# Altium project TAUV-Regulated_Power.PrjPcb (part 1 of 2)
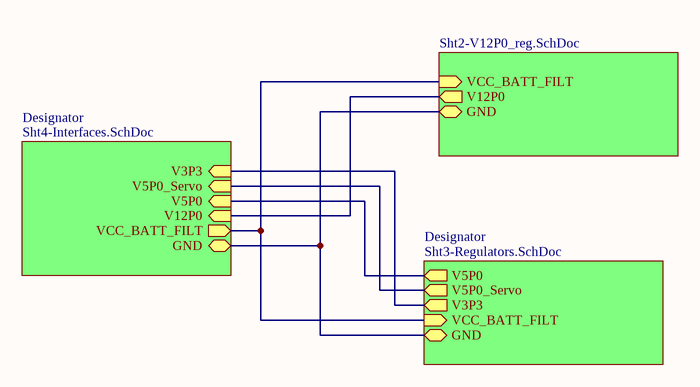
[diagram p0: Sht1-BlockDiagram.SchDoc]
4 sheets, 197 parts. Net scope: hierarchical (ports join the sheet entries above them; power ports are global).
Board file: TAUV-Regulated_Power_board.PcbDoc
Sheets:
  Sht1-BlockDiagram.SchDoc
    Designator = Sht4-Interfaces.SchDoc
  Sht2-Regulators.SchDoc
  Sht3-V12P0_reg.SchDoc

## Sheet Sht1-BlockDiagram.SchDoc
size A; SheetNumber: 1; SheetTotal: 4

### Sub-sheets
Designator = Sht4-Interfaces.SchDoc: VCC_BATT_FILT (out), V12P0 (in), V5P0 (in), V5P0_Servo (in), V3P3 (in), GND (bidir)
Designator = Sht3-Regulators.SchDoc (file not in this document): V5P0 (out), V5P0_Servo (out), V3P3 (out), VCC_BATT_FILT (in), GND (bidir)
? = Sht2-V12P0_reg.SchDoc (file not in this document): VCC_BATT_FILT (in), V12P0 (out), GND (bidir)

### Nets
V12P0: sheet Designator/V12P0, sheet /V12P0
(unnamed): sheet Designator/VCC_BATT_FILT, sheet /VCC_BATT_FILT, sheet Designator/VCC_BATT_FILT
(unnamed): sheet Designator/V5P0, sheet Designator/V5P0
(unnamed): sheet Designator/V5P0_Servo, sheet Designator/V5P0_Servo
(unnamed): sheet Designator/V3P3, sheet Designator/V3P3
(unnamed): sheet Designator/GND, sheet /GND, sheet Designator/GND

## Sheet Sht4-Interfaces.SchDoc
size C; SheetNumber: 4; SheetTotal: 4
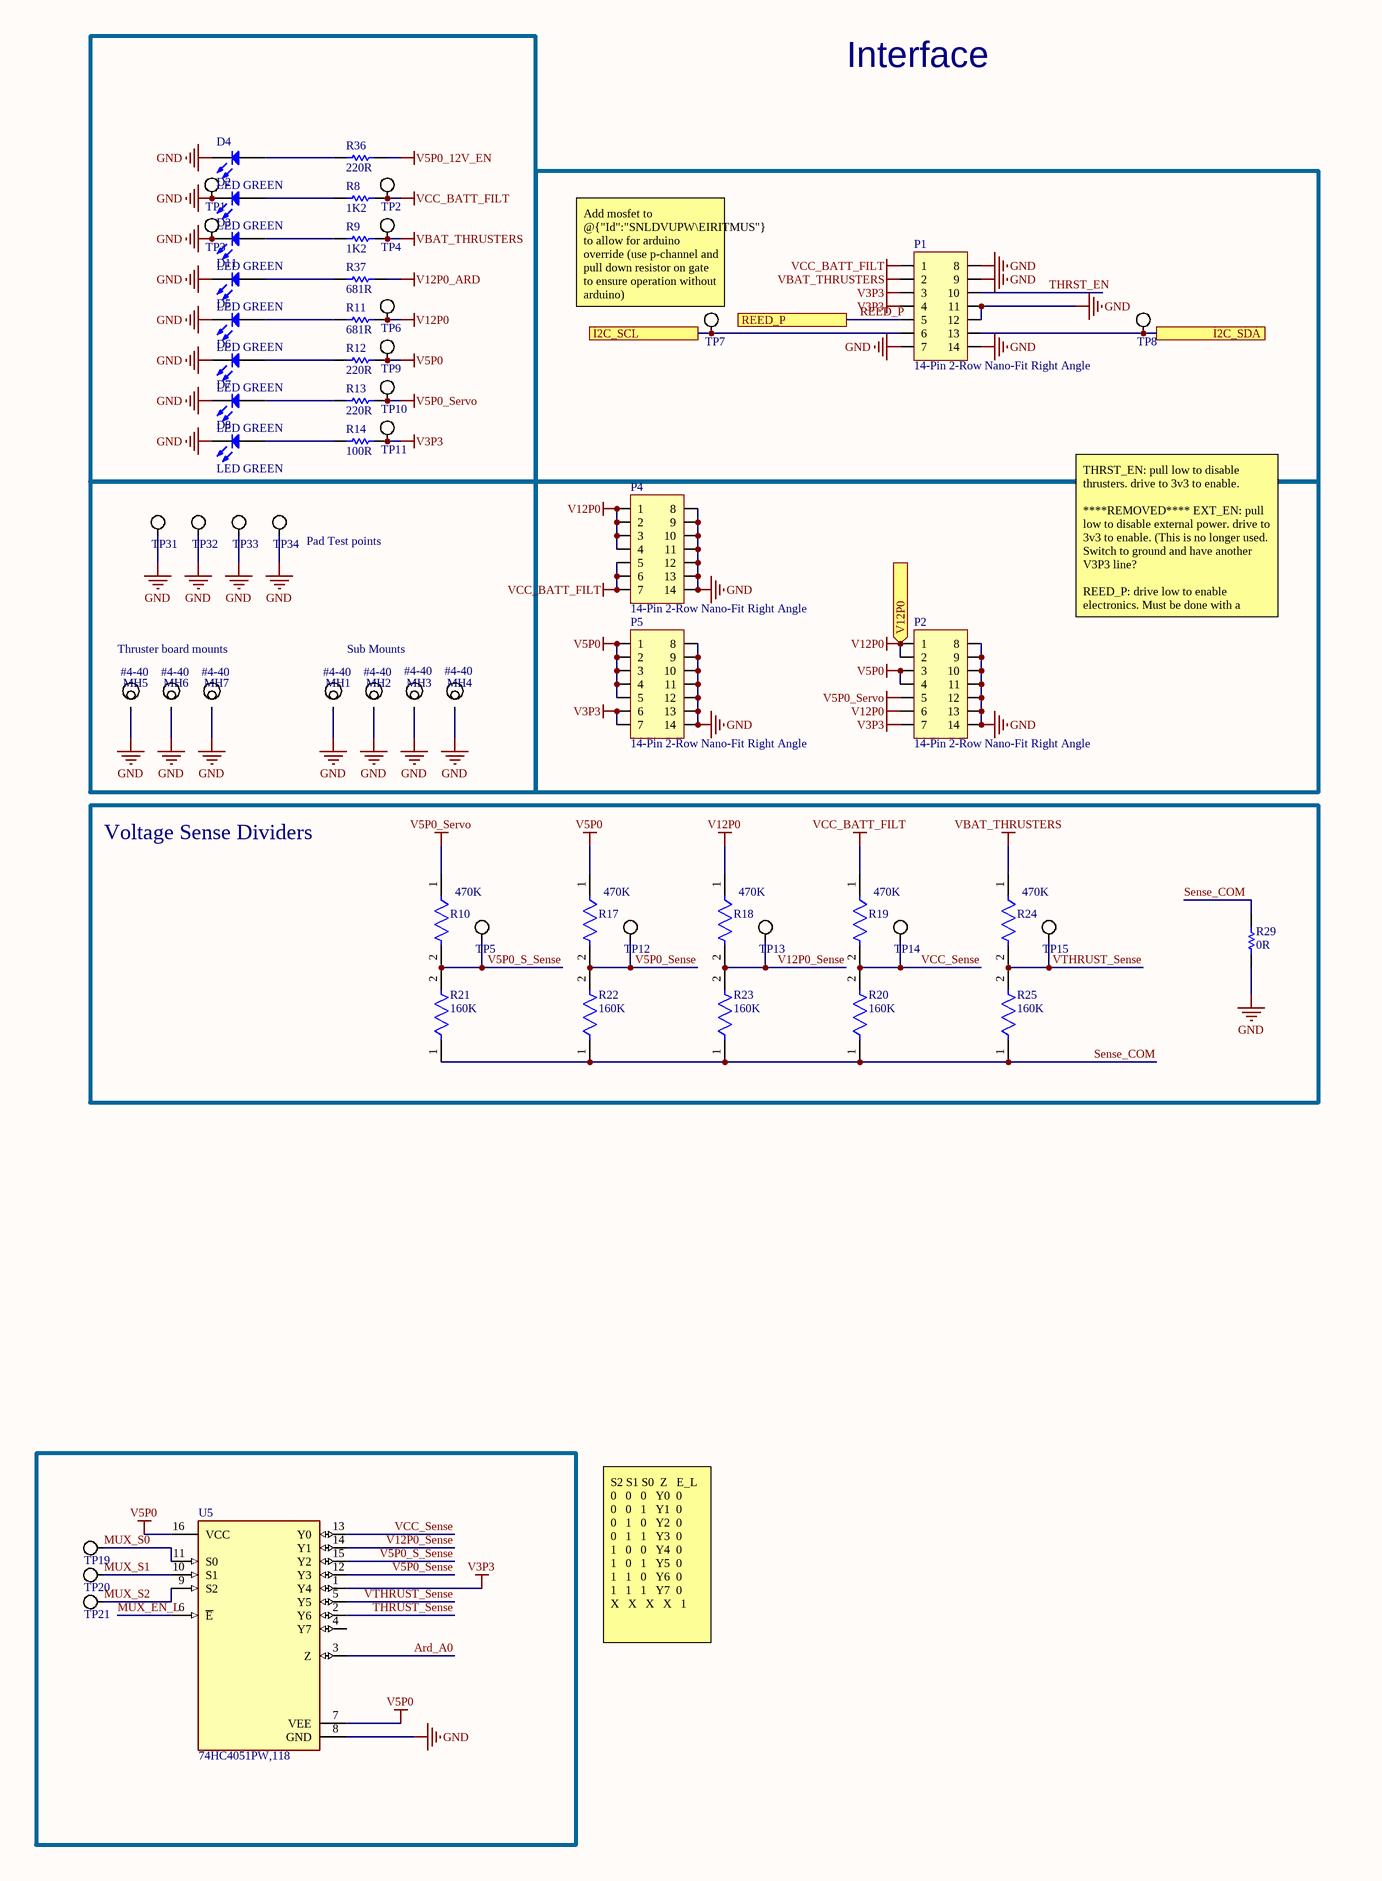
[diagram p1: Sht4-Interfaces.SchDoc, left]
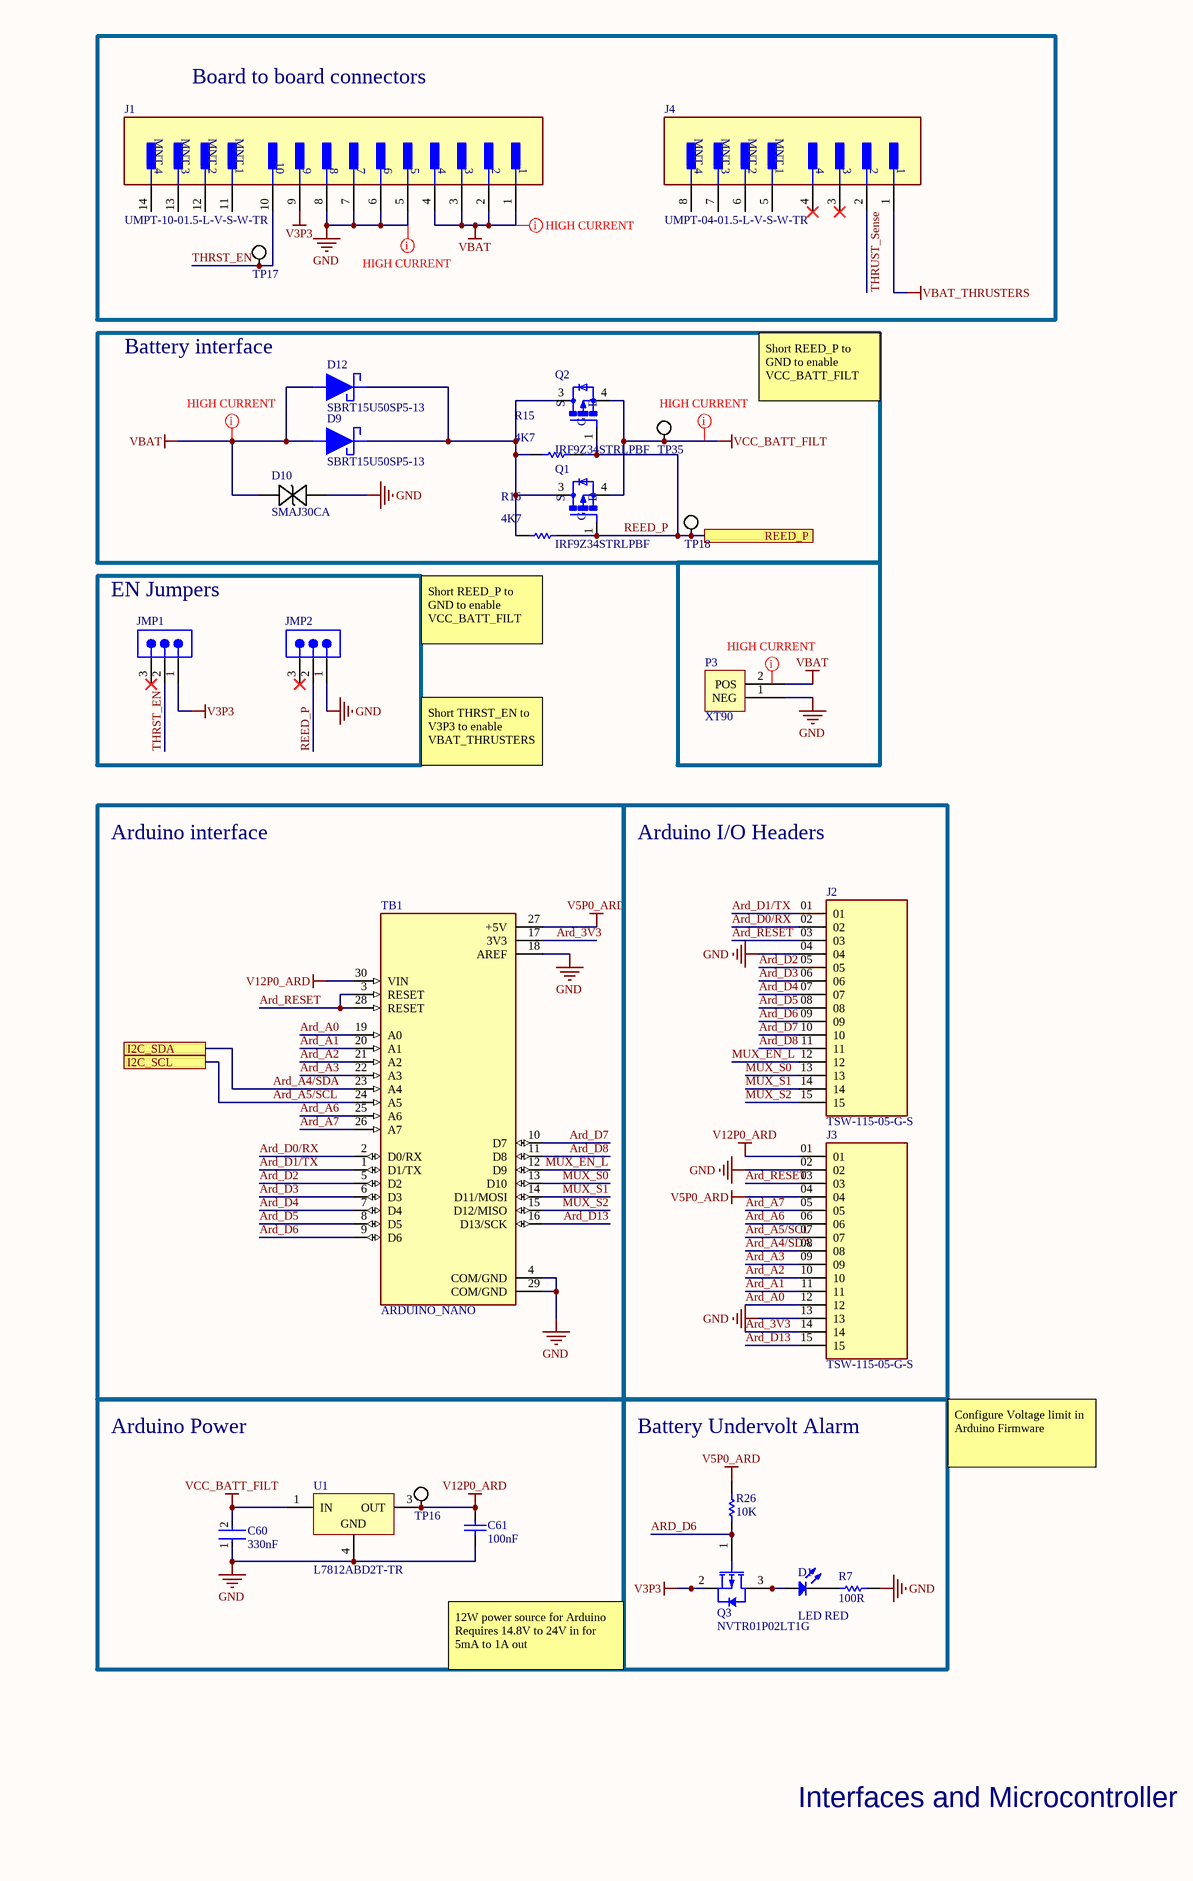
[diagram p2: Sht4-Interfaces.SchDoc, right]

### Parts
C60  330nF  [FP-C1608-080-0_1-IPC_A]
C61  100nF  [CAPC0603(1608)100_L]
D1  LED RED  [C0805]
D2  LED GREEN  [LED_0805]
D3  LED GREEN  [LED_0805]
D4  LED GREEN  [LED_0805]
D5  LED GREEN  [LED_0805]
D6  LED GREEN  [LED_0805]
D7  LED GREEN  [LED_0805]
D8  LED GREEN  [LED_0805]
D9  SBRT15U50SP5-13  [SBRT15U50SP5-13]
D10  SMAJ30CA  [SMASeries_LTF]
D11  LED GREEN  [LED_0805]
D12  SBRT15U50SP5-13  [SBRT15U50SP5-13]
J1  UMPT-10-01.5-L-V-S-W-TR  [FP-UMPT-10-01_5-L-V-S-W-T-MFG]
J2  TSW-115-05-G-S  [SAMTEC_TSW-115-05-G-S]
J3  TSW-115-05-G-S  [SAMTEC_TSW-115-05-G-S]
J4  UMPT-04-01.5-L-V-S-W-TR  [FP-UMPT-04-01_5-L-V-S-W-T-MFG]
JMP1  TSW-103-07-L-S  [SMTC-TSW-103-07-X-S]  (value not drawn)
JMP2  TSW-103-07-L-S  [SMTC-TSW-103-07-X-S]  (value not drawn)
MH1  #4-40  [Mounting Hole #4-40]
MH2  #4-40  [Mounting Hole #4-40]
MH3  #4-40  [Mounting Hole #4-40]
MH4  #4-40  [Mounting Hole #4-40]
MH5  #4-40  [Mounting Hole #4-40]
MH6  #4-40  [Mounting Hole #4-40]
MH7  #4-40  [Mounting Hole #4-40]
P1  14-Pin 2-Row Nano-Fit Right Angle  [MOLEX NANO-FIT 2X7 - Right Angle]
P2  14-Pin 2-Row Nano-Fit Right Angle  [MOLEX NANO-FIT 2X7 - Right Angle]
P3  XT90  [XT90]
P4  14-Pin 2-Row Nano-Fit Right Angle  [MOLEX NANO-FIT 2X7 - Right Angle]
P5  14-Pin 2-Row Nano-Fit Right Angle  [MOLEX NANO-FIT 2X7 - Right Angle]
Q1  IRF9Z34STRLPBF  [TO254P1521X483-4N]
Q2  IRF9Z34STRLPBF  [TO254P1521X483-4N]
Q3  NVTR01P02LT1G  [ONSC-SOT-23-3-318-08_V]
R7  100R  [RESC1609X50X30NL10T20]
R8  1K2  [RESC0603(1608)_L]
R9  1K2  [RESC0603(1608)_L]
R10  470K  [FP-CRCW0805-e3-IPC_C]
R11  681R  [RESC0603(1608)_L]
R12  220R  [RESC0603(1608)_L]
R13  220R  [RESC0603(1608)_L]
R14  100R  [RESC0603(1608)_L]
R15  4K7  [RESC0603(1608)_L]
R16  4K7  [RESC0603(1608)_L]
R17  470K  [FP-CRCW0805-e3-IPC_C]
R18  470K  [FP-CRCW0805-e3-IPC_C]
R19  470K  [FP-CRCW0805-e3-IPC_C]
R20  160K  [FP-CRCW0805-e3-IPC_C]
R21  160K  [FP-CRCW0805-e3-IPC_C]
R22  160K  [FP-CRCW0805-e3-IPC_C]
R23  160K  [FP-CRCW0805-e3-IPC_C]
R24  470K  [FP-CRCW0805-e3-IPC_C]
R25  160K  [FP-CRCW0805-e3-IPC_C]
R26  10K  [RESC1609X50X30NL8T20]
R29  0R  [RESC2013X50X30LL20T20]
R36  220R  [RESC0603(1608)_L]
R37  681R  [RESC0603(1608)_L]
TB1  ARDUINO_NANO  [SHIELD_ARDUINO_NANO]
TP1  Test Point Loop  [Test Point Loop - Black]  (value not drawn)
TP2  Test Point Loop  [Test Point Loop - Black]  (value not drawn)
TP3  Test Point Loop  [Test Point Loop - Black]  (value not drawn)
TP4  Test Point Loop  [Test Point Loop - Black]  (value not drawn)
TP5  (no value)  [Test Point Pad]
TP6  Test Point Loop  [Test Point Loop - Black]  (value not drawn)
TP7  Test Point Loop  [Test Point Loop - Black]  (value not drawn)
TP8  Test Point Loop  [Test Point Loop - Black]  (value not drawn)
TP9  Test Point Loop  [Test Point Loop - Black]  (value not drawn)
TP10  Test Point Loop  [Test Point Loop - Black]  (value not drawn)
TP11  Test Point Loop  [Test Point Loop - Black]  (value not drawn)
TP12  (no value)  [Test Point Pad]
TP13  (no value)  [Test Point Pad]
TP14  (no value)  [Test Point Pad]
TP15  (no value)  [Test Point Pad]
TP16  (no value)  [Test Point Pad]
TP17  (no value)  [Test Point Pad]
TP18  (no value)  [Test Point Pad]
TP19  (no value)  [Test Point Pad]
TP20  (no value)  [Test Point Pad]
TP21  (no value)  [Test Point Pad]
TP31  (no value)  [Test Point Pad]
TP32  (no value)  [Test Point Pad]
TP33  (no value)  [Test Point Pad]
TP34  (no value)  [Test Point Pad]
TP35  (no value)  [Test Point Pad]
U1  L7812ABD2T-TR  [TO-263_L]
U5  74HC4051PW,118  [FP-SOT403-1-IPC_A]

### Blocks framed on the sheet
Board to board connectors: J1 J4 TP17
Battery interface: D9 D10 D12 Q1 Q2 R15 R16 TP18 TP35
EN Jumpers: JMP1 JMP2
Voltage Sense Dividers: R10 R17-R25 R29 TP5 TP12-TP15
Arduino interface: TB1
Arduino I/O Headers: J2 J3
Arduino Power: C60 C61 TP16 U1
Battery Undervolt Alarm: D1 Q3 R7 R26

### Ports
I2C_SCL, I2C_SDA, REED_P, V12P0 (in, see Sht1-BlockDiagram[2B], Sht3-V12P0_reg[4B], Sht3-V12P0_reg[4C])

### Nets
GND: C60.1 C61.2 D2.1(K) D3.1(K) D4.1(K) D5.1(K) D6.1(K) D7.1(K) D8.1(K) D10.1 D11.1(K) J1.5 J1.6 J1.7 J1.8 J2.04 J3.02 J3.13 JMP2.1 MH1.0 MH2.0 MH3.0 MH4.0 MH5.0 MH6.0 MH7.0 P1.7 P1.8 P1.9 P1.11 P1.12 P1.14 P2.8 P2.9 P2.10 P2.11 P2.12 P2.13 P2.14 P3.1(NEG) P4.8 P4.9 P4.10 P4.11 P4.12 P4.13 P4.14 P5.8 P5.9 P5.10 P5.11 P5.12 P5.13 P5.14 R7.2 R29.2 TB1.4(COM/GND) TB1.18(AREF) TB1.29(COM/GND) TP1.1 TP3.1 TP31.1 TP32.1 TP33.1 TP34.1 U1.4(GND) U5.8(GND)
V3P3: J1.9 JMP1.1 P1.3 P1.4 P2.7 P5.6 P5.7 Q3.2(S) R14.2 TP11.1 U5.1(Y4)
V5P0: P2.3 P2.4 P5.1 P5.2 P5.3 P5.4 P5.5 R12.2 R17.1 TP9.1 U5.7(VEE) U5.16(VCC)
V5P0_12V_EN: R36.2
V5P0_ARD: J3.04 R26.2 TB1.27(+5V)
V5P0_Servo: P2.5 R10.1 R13.2 TP10.1
V12P0: P2.1 P2.2 P2.6 P4.1 P4.2 P4.3 P4.4 R11.2 R18.1 TP6.1 ; port V12P0
V12P0_ARD: C61.1 J3.01 R37.2 TB1.30(VIN) TP16.1 U1.3(OUT)
VBAT: D9.1 D10.2 D12.1 J1.1 J1.2 J1.3 J1.4 P3.2(POS)
VBAT_THRUSTERS: J4.1 P1.2 R9.2 R24.1 TP4.1
VCC_BATT_FILT: C60.2 P1.1 P4.5 P4.6 P4.7 Q1.4(D) Q2.4(D) R8.2 R19.1 TP2.1 TP35.1 U1.1(IN)
Ard_3V3: J3.14 TB1.17(3V3)
Ard_A0: J3.12 TB1.19(A0) U5.3(Z)
Ard_A1: J3.11 TB1.20(A1)
Ard_A2: J3.10 TB1.21(A2)
Ard_A3: J3.09 TB1.22(A3)
Ard_A4/SDA: J3.08 P1.13 TB1.23(A4) TP8.1 ; port I2C_SDA
Ard_A5/SCL: J3.07 P1.6 TB1.24(A5) TP7.1 ; port I2C_SCL
Ard_A6: J3.06 TB1.25(A6)
Ard_A7: J3.05 TB1.26(A7)
Ard_D0/RX: J2.02 TB1.2(D0/RX)
Ard_D1/TX: J2.01 TB1.1(D1/TX)
Ard_D2: J2.05 TB1.5(D2)
Ard_D3: J2.06 TB1.6(D3)
Ard_D4: J2.07 TB1.7(D4)
Ard_D5: J2.08 TB1.8(D5)
Ard_D6: J2.09 Q3.1(G) R26.1 TB1.9(D6)
Ard_D7: J2.10 TB1.10(D7)
Ard_D8: J2.11 TB1.11(D8)
Ard_D13: J3.15 TB1.16(D13/SCK)
Ard_RESET: J2.03 J3.03 TB1.3(RESET) TB1.28(RESET)
MUX_EN_L: J2.12 TB1.12(D9) U5.6(~{E})
MUX_S0: J2.13 TB1.13(D10) TP19.1 U5.11(S0)
MUX_S1: J2.14 TB1.14(D11/MOSI) TP20.1 U5.10(S1)
MUX_S2: J2.15 TB1.15(D12/MISO) TP21.1 U5.9(S2)
REED_P: JMP2.2 P1.5 Q1.1(G) Q2.1(G) R15.2 R16.2 TP18.1 ; port REED_P
Sense_COM: R20.1 R21.1 R22.1 R23.1 R25.1 R29.1
THRST_EN: J1.10 JMP1.2 P1.10 TP17.1
THRUST_Sense: J4.2 U5.2(Y6)
V5P0_S_Sense: R10.2 R21.2 TP5.1 U5.15(Y2)
V5P0_Sense: R17.2 R22.2 TP12.1 U5.12(Y3)
V12P0_Sense: R18.2 R23.2 TP13.1 U5.14(Y1)
VCC_Sense: R19.2 R20.2 TP14.1 U5.13(Y0)
VTHRUST_Sense: R24.2 R25.2 TP15.1 U5.5(Y5)
NetD1_1: D1.1(K) R7.1
NetD1_2: D1.2(A) Q3.3(D)
NetD2_2: D2.2(A) R8.1
NetD3_2: D3.2(A) R9.1
NetD4_2: D4.2(A) R36.1
NetD5_2: D5.2(A) R11.1
NetD6_2: D6.2(A) R12.1
NetD7_2: D7.2(A) R13.1
NetD8_2: D8.2(A) R14.1
NetD9_2: D9.2 D12.2 Q1.3(S) Q2.3(S) R15.1 R16.1
NetD11_2: D11.2(A) R37.1

Not connected (* = marked no-connect by the designer): J1 11(MNT_1) 12(MNT_2) 13(MNT_3) 14(MNT_4); J4 3* 4* 5(MNT_1) 6(MNT_2) 7(MNT_3) 8(MNT_4); JMP1 3*; JMP2 3*; U5 4(Y7)

### Layout directives
mark named HIGH CURRENT: (no net found under the mark), GND, VBAT, VCC_BATT_FILT

### Notes on the sheet
- Interface
- (near TP7) Add mosfet to @{"Id":"SNLDVUPW\EIRITMUS"} to allow for arduino override (use p-channel and pull down resistor on gate to ensure operation without arduino)
- Short REED_P to GND to enable VCC_BATT_FILT
- (near TP34) Pad Test points
- Thruster board mounts
- Sub Mounts
- THRST_EN: pull low to disable thrusters. drive to 3v3 to enable.
  ****REMOVED**** EXT_EN: pull low to disable external power. drive to 3v3 to enable. (This is no longer used. Switch to ground and have another V3P3 line?
  REED_P: drive low to enable electronics. Must be done with a hardware switch.
- Short THRST_EN to V3P3 to enable VBAT_THRUSTERS
- Configure Voltage limit in Arduino Firmware
- S2 S1 S0  Z   E_L
  0   0   0   Y0  0
  0   0   1   Y1  0
  0   1   0   Y2  0
  0   1   1   Y3  0
  1   0   0   Y4  0
  1   0   1   Y5  0
  1   1   0   Y6  0
  1   1   1   Y7  0
  X   X   X   X   1
- 12W power source for Arduino
  Requires 14.8V to 24V in for 5mA to 1A out
- Interfaces and Microcontroller

### Library data of the parts
C60 = 330nF 0603: Multilayer Ceramic Capacitors 330nF ±10% 50V X7R SMD 0603; Capacitance: 330nF; Case Code (Imperial): 0603; Case Code (Metric): 1608; Dielectric: X7R; Length: 1.6mm; Construction: Flat; Resistor Type: Ceramic; Mount: Surface Mount; Voltage Rating: 50V; Packaging: Tape and Reel; Series: C; Case/Package: 0603; Lead Free: Lead Free; Tolerance: 10%; Voltage: 50V; REACH SVHC: No SVHC; Height: 0.8mm; Weight: 7.1E-05oz; Termination: SMD/SMT; Max Operating Temperature: 125°C; RoHS Compliant: Yes; Min Operating Temperature: -55°C; Depth: 0.8mm; Package Quantity: 1; Thickness: 0.037inch; Voltage Rating (DC): 50V; Dielectric Material: Ceramic; Width: 0.031inch; ComponentLink1Description: Link; ComponentLink1URL: https://www.digikey.com/en/products/detail/tdk-corporation/C1608X7R1H334K080AC/2443428
C61 = 100nF 0603: CAP 100nF 100V ±10% 0603 (1608 Metric) Thickness 1mm SMD; Tolerance: Â±10%; Case-EIA: 0603; Case-Metric: 1608; Rated Voltage: 100 V; Value: 100nF; Technology: SMT; Max Thickness: 1 mm; ComponentLink1Description: Link; ComponentLink1URL: https://www.digikey.com/en/products/detail/samsung-electro-mechanics/CL10B104KC8NNNC/5961291
D1 = Red LED 0805: led / LTST-C171KRKT; Manufacturer: Lite-On Inc.; Lens Color: Colorless; Lens Transparency: Clear; Millicandela Rating: 54mcd; Lens Style/Size: Rectangle with Flat Top, 1.40mm x 1.25mm; Voltage - Forward (Vf) (Typ): 2V; Current - Test: 20mA; Viewing Angle: 130°; Wavelength - Dominant: 631nm; Wavelength - Peak: 639nm; Supplier 1: Digi-Key; Supplier Part Number 1: 160-1427-1-ND; Manufacturer Part Number: LTST-C171KRKT; RoHS: RoHS Compliant; Category: Optoelectronics; Stock 1: 260544; Pricing 1: 1=0.31, 10=0.225, 25=0.1656, 100=0.1183, 250=0.0804, 500=0.07096, 1000=0.05558 (USD); Packaging: Cut Tape (CT); Part Status: Active; Color: Red; Mounting Type: Surface Mount; Features: -; Package / Case: 0805 (2012 Metric); Size / Dimension: 2.00mm L x 1.25mm W; Height (Max): 0.80mm; ComponentLink1URL: http://optoelectronics.liteon.com/upload/download/DS22-2000-109/LTST-C171KRKT.pdf; ComponentLink1Description: http://optoelectronics.liteon.com/upload/download/DS22-2000-109/LTST-C171KRKT.pdf; ComponentLink2Description: Link; ComponentLink2URL: https://www.digikey.com/en/products/detail/liteon/LTST-C171KRKT/386801
D2-D8 D11 = Green LED 0805: led; Manufacturer: Lite-On Inc.; Manufacturer Part Number: LTST-C171KGKT; Lens Color: Colorless; Lens Transparency: Clear; Millicandela Rating: 35mcd; Lens Style/Size: Rectangle with Flat Top, 1.40mm x 1.25mm; Voltage - Forward (Vf) (Typ): 2V; Current - Test: 20mA; Viewing Angle: 130°; Wavelength - Dominant: 571nm; Wavelength - Peak: 574nm; Supplier 1: Digi-Key; Supplier Part Number 1: 160-1426-1-ND; RoHS: RoHS Compliant; Category: Optoelectronics; Stock 1: 350441; Pricing 1: 1=0.31, 10=0.225, 25=0.1656, 100=0.1183, 250=0.0804, 500=0.07096, 1000=0.05558 (USD); Packaging: Cut Tape (CT); Part Status: Active; Color: Green; Mounting Type: Surface Mount; Features: -; Package / Case: 0805 (2012 Metric); Size / Dimension: 2.00mm L x 1.25mm W; Height (Max): 0.90mm; ComponentLink1URL: http://optoelectronics.liteon.com/upload/download/DS22-2000-118/LTST-C171KGKT.pdf; ComponentLink1Description: http://optoelectronics.liteon.com/upload/download/DS22-2000-118/LTST-C171KGKT.pdf; ComponentLink2Description: Link; ComponentLink2URL: https://www.digikey.com/en/products/detail/LTST-C171KGKT/160-1426-1-ND/386798?curr=usd&utm_campaign=buynow&utm_medium=aggregator&utm_source=octopart
D10 = SMAJ30CA: No Description Available; Mfr_Name: Littelfuse Inc; Digi-Key_Part_Number_8: SMAJ30CALFTR-ND; Digi-Key_Part_Number_7: SMAJ30CALFDKR-ND; Digi-Key_Part_Number_1: 2516-SMAJ30CATR-ND; Digi-Key_Part_Number_2: 2997-SMAJ30CATR-ND; Digi-Key_Part_Number_3: SMAJ30CABCT-ND; Digi-Key_Part_Number_4: SMAJ30CABDKR-ND; Digi-Key_Part_Number_5: SMAJ30CABTR-ND; Digi-Key_Part_Number_6: SMAJ30CALFCT-ND
J1 = UMPT-10-1.5: CONN MPOWER 2MM MALE 10POS GOLD; System: Connector; ComponentLink1Description: Link; ComponentLink1URL: https://www.digikey.com/en/products/detail/samtec-inc/UMPT-10-01-5-L-V-S-W-TR/14670365?s=N4IgTCBcDaIKoFkAKAVAtARgAxqxgdAKxoAyaAamgMpoDqaKASiALoC%2BQA
J2 J3 = TSW-115-05-G-S: MF: Samtec; Value: *; Availability: Unavailable; Price: None; MP: TSW-115-05-G-S; Package: None
J4 = UMPT-04-1.5: CONN MPOWER 2MM MALE 4POS GOLD; ComponentLink1Description: Link; ComponentLink1URL: https://www.digikey.com/en/products/detail/samtec-inc/UMPT-04-01-5-L-V-S-W-TR/14670336?s=N4IgTCBcDaIKoFkAKAVAtABgCyYIwDoBWNAGTQDU0BlNAdTRQCUQBdAXyA
JMP1 JMP2 = 3 Pos .1" connector/jumper: 0.025" SQ Post Header, Through-hole, Vertical, -55 to 125 degC, 2.54 mm Pitch, 3-Pin, Male, RoHS; Manufacturer: Samtec; Pitch: 2.54 mm; Mounting Technology: Through-hole; ComponentLink2URL: http://www.samtec.com/documents/webfiles/pdf/TSW_TH.PDF; ComponentLink3Description: Package Specification; PackageVersion: DM, 8/1988; PartNumber: TSW-103-07-L-S; PackageReference: TSW-103-07-X-S; Orientation: Vertical; ComponentLink1URL: http://www.samtec.com; PackageDescription: .025[0.64] SQ. Post Terminal Strip Assembly; ComponentLink1Description: Manufacturer URL; ComponentLink2Description: Datasheet; ComponentLink3URL: http://www.samtec.com/documents/webfiles/cpdf/TSW-XXX-XX-XXX-X-XX-XXX-MKT.pdf; RoHS: True; DatasheetVersion: F-214; Temperature Range: -55 to 125 degC
MH1-MH7 = Mounting Hole #4-40, Loose Fit: Mounting Hole for ANSI #4-40 w/ Flat Washer, Loose Fit; Datasheet: http://blogs.mentor.com/tom-hausherr/blog/tag/pcb-mounting-holes/
P1 P2 P4 P5 = 14-Pin 2-Row Nano-Fit Right Angle: NanoFit Right Hdr TH DR 14Ckt; Part Number: 105314-1214; Manufacturer: Molex; Supplier: Mouser; Supplier Part Number: 538-105314-1214; Supplier 1: Mouser; Supplier Part Number 1: 538-105314-1214; ComponentLink1Description: Mouser Link; ComponentLink1URL: https://www.mouser.com/ProductDetail/Molex/105314-1214?qs=PqFvFmEiOr6wLIXpvlvqbA%3D%3D; ComponentLink2Description: Link; ComponentLink2URL: https://www.digikey.com/en/products/detail/molex/1053141114/7693193
Q1 Q2 = IRF9Z34STRLPBF: P-Channel 60V 18A _Tc_ 3.7W _Ta_, 88W _Tc_ Surface Mount D2PAK; MF: Vishay; Package: D2PAK Vishay; Value: *; Availability: Unavailable; MP: IRF9Z34STRLPBF; Price: None; SnapEDA_Link: https://www.snapeda.com/parts/IRF9Z34STRLPBF/Vishay%20Siliconix/view-part/813693/?ref=snap
Q3 = PMOS SOT-23: Power MOSFET, -20 V, -1.3 A, P-Channel, 3-Pin SOT-23, Pb-Free, Tape and Reel; Manufacturer: On Semiconductor; Ciss Typ (pF): 225; Configuration: Single; Coss Typ (pF): 130; PD Max (W): 0.4; ID Max (A): 1.3; Crss Typ (pF): 55; VGS Max (V): 12; V(BR)DSS Min (V): 20; VGS(th) Max (V): 1.25; Qrr Typ (nC): 8.5; Channel Polarity: P Channel; ComponentLink1URL: http://www.onsemi.com/; PackageReference: SOT-23-3-318-08; RoHS: Pb-Free; ComponentLink1Description: Manufacturer URL; PackageDescription: 3-Pin Small Outline Transistor, Body 2.92 x 1.3 mm, Pitch 0.95 mm; ComponentLink3Description: Package Specification; ComponentLink2Description: Datasheet; Package Type: SOT-23-3; ComponentLink2URL: http://www.onsemi.cn/pub_link/Collateral/NTR1P02LT1-D.PDF; Packing: Tape and Reel; Mounting Technology: Surface Mount; ComponentLink3URL: http://www.onsemi.cn/pub_link/Collateral/318-08.PDF; PartNumber: NVTR01P02LT1G; PackageVersion: Rev. AP, 11/2009; DatasheetVersion: Rev. 13; ComponentLink4Description: Link; ComponentLink4URL: https://www.digikey.com/en/products/detail/vishay-siliconix/IRF9Z34STRLPBF/856689?s=N4IgTCBcDaIJICUBiBOAWgZgCwGUAqCAMgAoBCSIAugL5A
R7 = 100R 0603: 100R 0.1W 5%; Part Number: CRCW0603100RJNTA; Manufacturer: Vishay Dale; ComponentLink1Description: Link; ComponentLink1URL: https://www.digikey.com/en/products/detail/yageo/RC0603FR-13100RL/12756392
R8 R9 = CMP-1012-00518-1: 1K2 0.1W 1% 0603 (1608 Metric)  SMD; Case-EIA: 0603; Value: 1200.00 Ohm; Case-Metric: 1608; Power: 0.1 W; Technology: SMT; Tolerance: 1 %
R10 R17-R19 R24 = 470K 0805: RES Thick Film, 470kΩ, 1%, 0.125W, 100ppm/°C, 0805; Power Rating: 125mW; Voltage Rating (DC): 150V; Depth: 1.25mm; Voltage Rating: 150V; Composition: Thick Film; Temperature Coefficient: 100ppm/°C; Max Operating Temperature: 155°C; Min Operating Temperature: -55°C; Package Quantity: 10; Width: 0.049inch; Number of Pins: 2; Length: 2mm; Case Code (Metric): 2012; Weight: 0.000194oz; Features: Automotive AEC-Q200; Number of Terminations: 2; Radiation Hardening: No; Height: 0.45mm; Military Standard: Not; Tolerance: 1%; Lead Free: Lead Free; Termination: SMD/SMT; Case Code (Imperial): 0805; Case/Package: 0805; Contact Plating: Tin; Packaging: Tape and Reel; Max Power Dissipation: 125mW; ComponentLink1Description: Link; ComponentLink1URL: https://www.digikey.com/en/products/detail/yageo/RC0805FR-07470KL/727977
R11 R37 = CMP-1012-00492-1: 681R 0.1W 1% 0603 (1608 Metric)  SMD; Value: 681.00 Ohm; Case-Metric: 1608; Case-EIA: 0603; Technology: SMT; Tolerance: 1 %; Power: 0.1 W
R12 R13 R36 = CMP-1012-00058-1: 220R 0.1W 5% 0603 (1608 Metric)  SMD; Case-EIA: 0603; Case-Metric: 1608; Value: 220.00 Ohm; Technology: SMT; Power: 0.1 W; Tolerance: 5 %
R14 = CMP-1012-00050-1: 100R 0.1W 5% 0603 (1608 Metric)  SMD; Case-EIA: 0603; Value: 100.00 Ohm; Case-Metric: 1608; Tolerance: 5 %; Technology: SMT; Power: 0.1 W
R15 R16 = 4K7 0603: 4K7 0.1W 1% 0603 (1608 Metric)  SMD; Case-EIA: 0603; Case-Metric: 1608; Value: 4700.00 Ohm; Power: 0.1 W; Tolerance: 1 %; Technology: SMT; ComponentLink1Description: Link; ComponentLink1URL: https://www.digikey.com/en/products/detail/yageo/RC0603FR-074K7L/727212
R20-R23 R25 = 160K 0805: RES Thick Film, 160kΩ, 1%, 0.125W, 100ppm/°C, 0805; Voltage Rating: 150V; Power Rating: 125mW; Width: 1.25mm; Case/Package: 0805; Package Quantity: 5000; Temperature Coefficient: 100ppm/°C; Length: 2mm; Height: 0.45mm; Weight: 0.000194oz; Mount: Surface Mount; Case Code (Metric): 2012; Min Operating Temperature: -55°C; Termination: SMD/SMT; Case Code (Imperial): 0805; Number of Pins: 2; Packaging: Tape and Reel; Max Operating Temperature: 155°C; Radiation Hardening: No; Military Standard: Not; Depth: 1.25mm; Tolerance: 1%; Composition: Thick Film; Contact Plating: Tin; ComponentLink1Description: Link; ComponentLink1URL: https://www.digikey.com/en/products/detail/yageo/RC0805FR-07160KL/727628
R26 = 10K 0603: Chip Resistor, 10 KOhm, +/- 1%, 100 mW, -55 to 155 degC, 0603 (1608 Metric), RoHS, Tape and Reel; Manufacturer: Vishay Semiconductor; Voltage Rating: 75 V; Max Operating Temperature: 155 degC; PackageDescription: 2-Pin Surface Mount Device, Body 1.575 x 0.85 mm; ComponentLink1Description: Manufacturer URL; RoHSCompliant: true; PackageReference: 0603; REACH SVHC: Unknown; Length: 1.55 mm; DatasheetVersion: 06/2012; Packaging: Tape and Reel; Min Operating Temperature: -55 degC; Mounting Technology: Surface Mount; ComponentLink2URL: https://datasheet.ciiva.com/11809/0900766b80d98afc-11809037.pdf; Height: 0.45 mm; ComponentLink2Description: Datasheet; Package Quantity: 5000; ComponentLink1URL: http://www.vishay.com/; ComponentLink3Description: Link; ComponentLink3URL: https://www.digikey.com/en/products/detail/stackpole-electronics-inc/RNCP0603FTD10K0/2240139
R29 = 0R 0805: 0 Ohm 0805; Manufacturer: Vishay Dale; Part Number: CRCW08050000Z0EA; ComponentLink1Description: Link; ComponentLink1URL: https://www.digikey.com/en/products/detail/stackpole-electronics-inc/RMCF0805ZT0R00/1756901
TB1 = ARDUINO_NANO: Small, complete, and breadboard-friendly board based on the ATmega328 (Arduino Nano 3.x); Check_prices: https://www.snapeda.com/parts/Arduino%20Nano/Arduino/view-part/?ref=eda; Value: *; Availability: Not in stock; MP: Arduino Nano; Price: None; Package: Non-Standard Arduino; SnapEDA_Link: https://www.snapeda.com/parts/Arduino%20Nano/Arduino/view-part/?ref=snap; MF: Arduino
TP1-TP4 TP6-TP11 = Test Point Loop: Keyston Electronics 5001 Test Point Loop; Manufacturer P/N: 5001; Manufacturer: Keystone Electronics; Color: Black; Supplier 1: Digi-Key; Supplier Part Number 1: 36-5001-ND
TP5 TP12-TP21 TP31-TP35 = Test Point Pad: Test point, Pad, 28 mil
U1 = L7812ABD2T-TR: Positive Voltage Regulator, 3-Pin D2PAK, Tape and Reel; ComponentLink1Description: Manufacturer URL; ComponentLink2URL: http://www.st.com/internet/com/TECHNICAL_RESOURCES/TECHNICAL_LITERATURE/DATASHEET/CD00000444.pdf; PackageVersion: 2011; PackageDescription: 3-Pin Transistor Outline Package 2.54 mm Pitch, 15.4 mm Lead Span (D2PAK); DatasheetVersion: 16/11/2011; PackageReference: TO-263; ComponentLink1URL: http://www.st.com; ComponentLink2Description: Datasheet; ComponentLink3Description: Link; ComponentLink3URL: https://www.digikey.com/en/products/detail/stmicroelectronics/L7812ABD2T-TR/1038261?s=N4IgTCBcDaIDIHYAcBGMBBAQgETAFQFo8AlEAXQF8g
U5 = 74HC4051PW,118: IC MUX/DEMUX 8X1 16TSSOP; RoHS Compliant: Yes; ComponentLink1Description: Link; ComponentLink1URL: https://www.digikey.com/en/products/detail/nexperia-usa-inc/74HC4051PW-118/946649
D9 D12 = SBRT15U50SP5-13: Supplier 1: Digi-Key; Supplier Part Number 1: SBRT15U50SP5-13DICT-ND

## Sheet Sht2-Regulators.SchDoc
size B; SheetNumber: 2; SheetTotal: 4
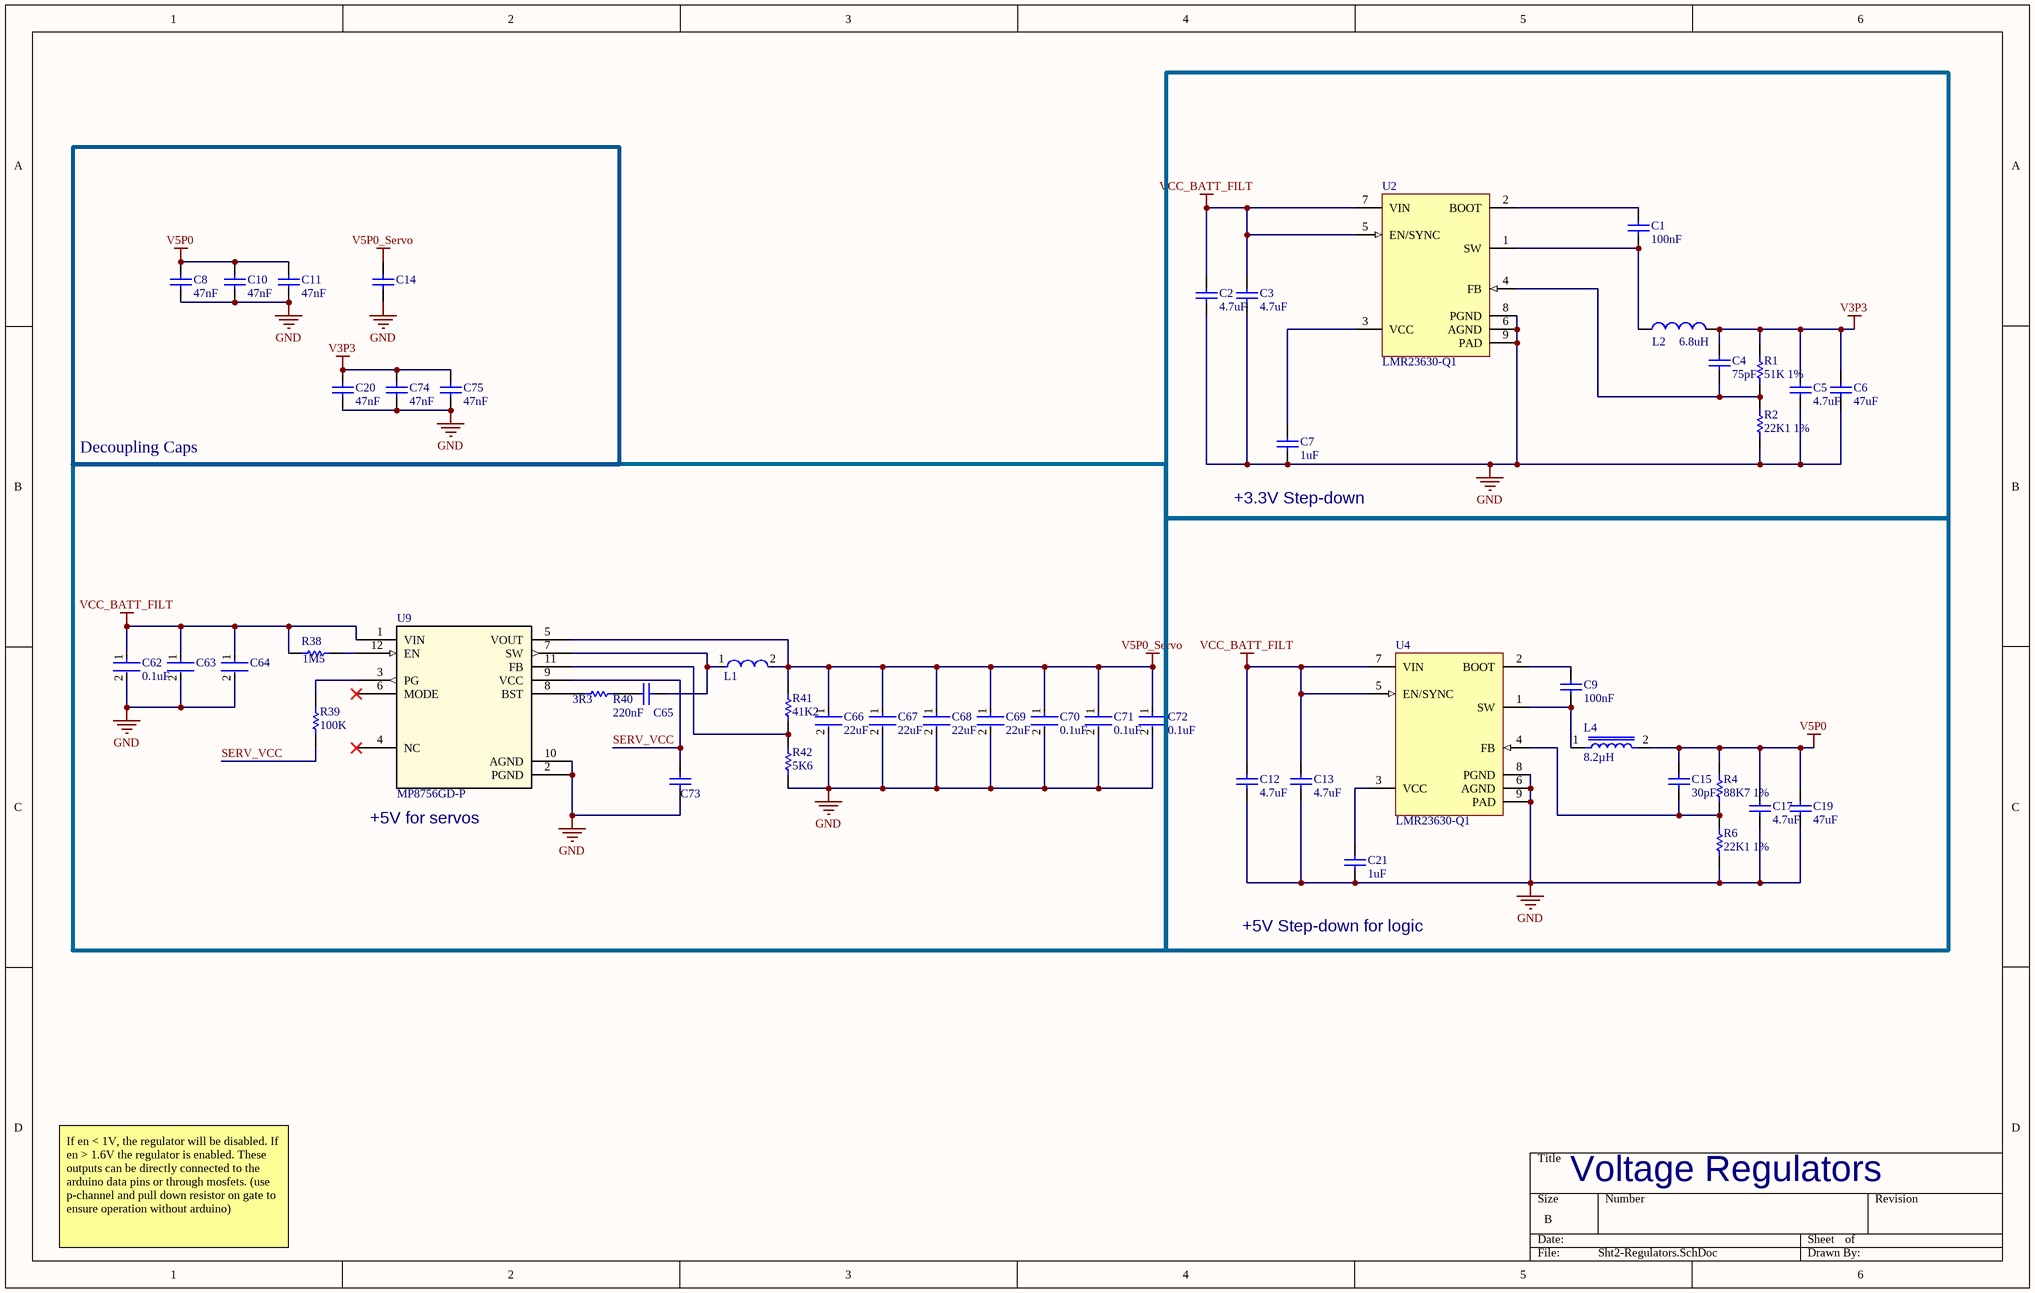
[diagram p3: Sht2-Regulators.SchDoc]

### Parts
C1  100nF  [CAPC0603(1608)100_L]
C2  4.7uF  [CAPC1206(3216)190_L]
C3  4.7uF  [CAPC1206(3216)190_L]
C4  75pF  [CAPC0603(1608)100_L]
C5  4.7uF  [CAPC1206(3216)190_L]
C6  47uF  [CAPC1206(3216)190_L]
C7  1uF  [CAPC0603(1608)100_L]
C8  47nF  [CAPC1608X90X35LL10T15]
C9  100nF  [CAPC0603(1608)100_L]
C10  47nF  [CAPC1608X90X35LL10T15]
C11  47nF  [CAPC1608X90X35LL10T15]
C12  4.7uF  [CAPC1206(3216)190_L]
C13  4.7uF  [CAPC1206(3216)190_L]
C14  (no value)  [CAPC1608X90X35LL10T15]
C15  30pF  [0603]
C17  4.7uF  [CAPC1206(3216)190_L]
C19  47uF  [CAPC1206(3216)190_L]
C20  47nF  [CAPC1608X90X35LL10T15]
C21  1uF  [CAPC0603(1608)100_L]
C62  0.1uF  [FP-CC0603-DA-MFG]
C63  (no value)  [0603]
C64  (no value)  [0603]
C65  220nF  [CAPC1608X87X35NL15T15]
C66  22uF  [0603]
C67  22uF  [0603]
C68  22uF  [0603]
C69  22uF  [0603]
C70  0.1uF  [FP-CC0603-DA-MFG]
C71  0.1uF  [FP-CC0603-DA-MFG]
C72  0.1uF  [FP-CC0603-DA-MFG]
C73  (no value)  [0603]
C74  47nF  [CAPC1608X90X35LL10T15]
C75  47nF  [CAPC1608X90X35LL10T15]
L1  (no value)  [FP-IHLP-2525CZ-FP_2_413x3-MFG]
L2  6.8uH  [BOURNS SRP5030T]
L4  8.2µH  [IND_SRP6540-8R2M]
R1  51K 1%  [RESC0603(1608)_L]
R2  22K1 1%  [RESC0603(1608)_L]
R4  88K7 1%  [RESC0603(1608)_L]
R6  22K1 1%  [RESC0603(1608)_L]
R38  1M5  [RESC1609X50X30NL10T20]
R39  100K  [0603]
R40  3R3  [RESC1608X55X30NL15T15]
R41  41K2  [RESC1608X55X30LL20T20]
R42  5K6  [RESC1609X55X30LL15T15]
U2  LMR23630-Q1  [DDA0008E_N]
U4  LMR23630-Q1  [DDA0008E_N]
U9  MP8756GD-P  [QFN-12_MP8756_MNP]

### Blocks framed on the sheet
+3.3V Step-down: C1-C7 L2 R1 R2 U2
Decoupling Caps: C8 C10 C11 C14 C20 C74 C75
+5V for servos: C62-C73 L1 R38-R42 U9

### Nets
GND: C2.2 C3.2 C5.2 C6.2 C7.2 C8.2 C10.2 C11.2 C12.2 C13.2 C14.2 C17.2 C19.2 C20.2 C21.2 C62.2 C63.2 C64.2 C66.2 C67.2 C68.2 C69.2 C70.2 C71.2 C72.2 C73.1 C74.2 C75.2 R2.2 R6.2 R42.2 U2.6(AGND) U2.8(PGND) U2.9(PAD) U4.6(AGND) U4.8(PGND) U4.9(PAD) U9.2(PGND) U9.10(AGND)
V3P3: C4.1 C5.1 C6.1 C20.1 C74.1 C75.1 L2.2 R1.1
V5P0: C8.1 C10.1 C11.1 C15.1 C17.1 C19.1 L4.2 R4.1
V5P0_Servo: C14.1 C66.1 C67.1 C68.1 C69.1 C70.1 C71.1 C72.1 L1.2 R41.1 U9.5(VOUT)
VCC_BATT_FILT: C2.1 C3.1 C12.1 C13.1 C62.1 C63.1 C64.1 R38.1 U2.5(EN/SYNC) U2.7(VIN) U4.5(EN/SYNC) U4.7(VIN) U9.1(VIN)
SERV_VCC: C73.2 R39.2 U9.9(VCC)
NetC1_1: C1.1 U2.2(BOOT)
NetC1_2: C1.2 L2.1 U2.1(SW)
NetC4_2: C4.2 R1.2 R2.1 U2.4(FB)
NetC7_1: C7.1 U2.3(VCC)
NetC9_1: C9.1 U4.2(BOOT)
NetC9_2: C9.2 L4.1 U4.1(SW)
NetC15_2: C15.2 R4.2 R6.1 U4.4(FB)
NetC21_1: C21.1 U4.3(VCC)
NetC65_1: C65.1 R40.2
NetC65_2: C65.2 L1.1 U9.7(SW)
NetR38_2: R38.2 U9.12(EN)
NetR39_1: R39.1 U9.3(PG)
NetR40_1: R40.1 U9.8(BST)
NetR41_2: R41.2 R42.1 U9.11(FB)

Not connected (* = marked no-connect by the designer): U9 4(NC)* 6(MODE)*

### Notes on the sheet
- (near C21) +5V Step-down for logic
- If en < 1V, the regulator will be disabled. If en > 1.6V the regulator is enabled. These outputs can be directly connected to the arduino data pins or through mosfets. (use p-channel and pull down resistor on gate to ensure operation without arduino)
- Voltage Regulators

### Library data of the parts
C1 C9 = 100nF 0603: as C61 on sheet Sht4-Interfaces; Rated Voltage: 100 V; Value: 100nF; Technology: SMT; Max Thickness: 1 mm; ComponentLink1Description: Link; ComponentLink1URL: https://www.digikey.com/en/products/detail/samsung-electro-mechanics/CL10B104KC8NNNC/5961291
C2 C3 C5 C12 C13 C17 = 4.7uF 1206: CAP 4.7uF 35V ±10% 1206 (3216 Metric) Thickness 1.9mm SMD; Case-EIA: 1206; Tolerance: Â±10%; Case-Metric: 3216; Rated Voltage: 35 V; Technology: SMT; Value: 4.7uF; Max Thickness: 1.9 mm; ComponentLink1Description: Link; ComponentLink1URL: https://www.digikey.com/en/products/detail/samsung-electro-mechanics/CL31B475KBHNFNE/3888837
C4 = 75pF 0603: CAP 75pF 25V ±1% 0603 (1608 Metric) Thickness 1mm SMD; Case-Metric: 1608; Case-EIA: 0603; Tolerance: Â±1%; Rated Voltage: 25 V; Technology: SMT; Max Thickness: 1 mm; Value: 75pF; ComponentLink1Description: Link; ComponentLink1URL: https://www.digikey.com/en/products/detail/yageo/CC0603FRNPO9BN750/5883517
C6 C19 = 47uF 1206: CAP 47uF 16V ±20% 1206 (3216 Metric) Thickness 1.9mm SMD; Case-EIA: 1206; Tolerance: Â±20%; Case-Metric: 3216; Rated Voltage: 16 V; Technology: SMT; Value: 47uF; Max Thickness: 1.9 mm; ComponentLink1Description: Link; ComponentLink1URL: https://www.digikey.com/en/products/detail/taiyo-yuden/EMK316BBJ476ML-T/7067010
C7 C21 = 1uF 0603: CAP 1uF 25V ±10% 0603 (1608 Metric) Thickness 1mm SMD; Tolerance: Â±10%; Case-Metric: 1608; Case-EIA: 0603; Technology: SMT; Rated Voltage: 25 V; Max Thickness: 1 mm; Value: 1uF; ComponentLink1Description: Link; ComponentLink1URL: https://www.digikey.com/en/products/detail/samsung-electro-mechanics/CL10B105KA8NNNC/3886842
C8 C10 C11 C14 C20 C74 C75 = 47nF 0603: Manufacturer: Murata; Part Number: GRM188R71E473KA01D; ComponentLink1Description: Link; ComponentLink1URL: https://www.digikey.com/en/products/detail/kemet/C0603X473J4RECAUTO7411/8654446
C15 = 30pF 0603: CAP 30pF 50V ±10% 0603 (1608 Metric) Thickness 1mm SMD; Tolerance: Â±10%; Case-Metric: 1608; Rated Voltage: 50 V; Technology: SMT; Value: 30pF; Max Thickness: 1 mm; Case-EIA: 0603; ComponentLink1Description: Link; ComponentLink1URL: https://www.digikey.com/en/products/detail/stackpole-electronics-inc/CML0603C0G300JT50V/10659967
C62 C70-C72 = 0.1uF 0603: CC0603KRX7R9BB104-CAP CER 0.1UF 50V X7R 0603; Manufacturer: YAGEO; Material: Ceramic; Capacitance: 100 nF; Temperature Coefficient: 15%; Tolerance: 0.1; Value: 100 nF; Height: 0.9mm; Voltage: 50 V; ComponentLink2Description: Datasheet; Device Class L2: Capacitors; Temperature Range High: +125°C; Category: Cap; Footprint Url: http://www.yageo.com/exep/pages/download/literatures/UPY-C_GEN_24.pdf; ComponentLink2URL: http://www.yageo.com/documents/recent/UPY-GPHC_X7R_6.3V-to-50V_18.pdf; Package: CC0603-DA; Temperature: -55°C to +125°C; Voltage Rating: 50 V; Temperature Characteristic: X7R; Device Class L1: Passive Components; Temperature Range Low: -55°C; Manufacturer Part Number: CC0603KRX7R9BB104; RoHS: TRUE; Automotive: No; Device Class L3: Ceramic Capacitors; Octopart: https://octopart.com/cc0603krx7r9bb104-yageo-42244635; Mouser Description: Multilayer Ceramic Capacitor, CC Series, 0.1 - F, - 10%, X7R, 50 V, 0603 [1608 Metric]; Lead Free: Yes; Digikey Description: CAP CER 0.1UF 50V X7R 0603; ComponentLink3Description: Link; ComponentLink3URL: https://www.digikey.com/en/products/detail/samsung-electro-mechanics/CL10B104KB8NNWC/3887593
C63 C64 C66-C69 = 22uF 0603: Cap Ceramic 22uF 10V X5R ±20% Pad SMD 0603 +85°C T/R; Max Operating Temperature: 85°C; Packaging: Tape and Reel; Mount: Surface Mount; Width: 0.031inch; Length: 0.063inch; Min Operating Temperature: -55°C; Voltage Rating: 10V; Case/Package: 0603; Thickness: 0.037inch; Case Code (Metric): 1608; Tolerance: 20%; Case Code (Imperial): 0603; Capacitance: 22uF; ComponentLink1Description: Link; ComponentLink1URL: https://www.digikey.com/en/products/detail/samsung-electro-mechanics/CL10B224KB8VPNC/5961084
C65 = 220nF 0603: C0603C224K8NACTU-220nF 0603; Manufacturer: Kemet; Part Number: C0603C224K8NACTU; ComponentLink1Description: Link; ComponentLink1URL: https://www.digikey.com/en/products/detail/kemet/C0603C224K4RECAUTO/8640476
C73 = 1uF 0603: CAP 1uF 25V ±10% 0603 (1608 Metric) Thickness 1mm SMD; Tolerance: Â±10%; Case-Metric: 1608; Value: 1uF; Technology: SMT; Rated Voltage: 25 V; Case-EIA: 0603; Max Thickness: 1 mm; ComponentLink1Description: Link; ComponentLink1URL: https://www.digikey.com/en/products/detail/samsung-electro-mechanics/CL10B105KA8NNNC/3886842
L1 = 1.5uH 9A inductor: Commercial Inductors, High Saturation Series 1.5uH 9A 15mΩ 20%; DC Resistance (DCR): 15mR; Shielding: Shielded; Self Resonant Frequency: 5MHz; Max DC Current: 18A; Test Frequency: 100kHz; Core Material: Metal; Packaging: Tape and Reel; RMS Current (Irms): 9A; Length: 7.24mm; Case Code (Imperial): 2525; Case/Package: 2525; Min Operating Temperature: -55°C; Number of Pins: 2; Contact Plating: Tin; Height: 3mm; Height - Seated (Max): 0.118inch; Termination: SMD/SMT; Max Operating Temperature: 125°C; Depth: 6.72mm; Width: 6.47mm; Current Rating: 9A; Tolerance: 20%; Lead Free: Lead Free; Military Standard: Not; Radiation Hardening: No; Saturation Current: 18A; Package Quantity: 2000; Inductance Tolerance: 20%; Inductance: 1.5uH; Mount: Surface Mount; ComponentLink1Description: Link; ComponentLink1URL: https://www.digikey.com/en/products/detail/vishay-dale/IHLP2525CZER1R5M01/1220672
L2 = SRP5030TA: Manufacturer: Bourns Inc.; Manufacturer Part Number: SRP5030TA-6R8M; Type: Wirewound; Material - Core: Carbonyl Powder; Tolerance: ±20%; Shielding: Shielded; DC Resistance (DCR): 76.2 mOhm Max; Q @ Freq: 15 @ 100kHz; Supplier 1: Digi-Key; RoHS: RoHS Compliant; Category: Inductors, Coils, Chokes; Stock 1: 5626; Pricing 1: 1=1.51, 10=1.397, 100=0.9781, 500=0.79178, 1000=0.72191 (USD); Packaging: Cut Tape (CT); Part Status: Active; Ratings: AEC-Q200; Operating Temperature: -40°C ~ 150°C; Mounting Type: Surface Mount; Package / Case: Nonstandard; Supplier Device Package: -; Size / Dimension: 0.224" L x 0.205" W (5.70mm x 5.20mm); Height - Seated (Max): 0.118" (3.00mm); ComponentLink1URL: http://www.bourns.com/docs/Product-Datasheets/SRP5030TA.pdf; ComponentLink1Description: http://www.bourns.com/docs/Product-Datasheets/SRP5030TA.pdf; Supplier Part Number 1: SRP5030TA-6R8MCT-ND; ComponentLink2Description: Link; ComponentLink2URL: https://www.digikey.com/en/products/detail/bourns-inc/SRP5030TA-6R8M/5429675?s=N4IgjCBcoEwAwA4DsVQGMoDMCGAbAzgKYA0IA9lANogBsAdAgAQCtAEiALqkAOALlCACqAOwCWvAPKYAsoWz4ArgCdCIAL5rSMKiADKAJQAKAVjgBmOABUAgpzVA
L4 = SRP6540-8R2M: 8.2µH Shielded Wirewound Inductor 4.5A 50.5mOhm Max Nonstandard; MF: Bourns; ComponentLink1URL: https://www.digikey.com/en/products/detail/bourns-inc/SRP6540-8R2M/3986098?s=N4IgTCBcDaIMoCUAKA2ArAFgAwFoAcCYAsiALoC%2BQA; ComponentLink1Description: Link; MP: SRP6540-8R2M; Package: Nonstandard Bourns; Digi-Key_Part_Number: SRP6540-8R2MCT-ND; Purchase-URL: https://pricing.snapeda.com/search/part/SRP6540-8R2M/?ref=eda; SnapEDA_Link: https://www.snapeda.com/parts/SRP6540-8R2M/Bourns/view-part/1329449/?ref=snap; Value: *
R1 = 51K 0603: 51K 0.1W 1% 0603 (1608 Metric)  SMD; Case-EIA: 0603; Case-Metric: 1608; Value: 51000.00 Ohm; Tolerance: 1 %; Technology: SMT; Power: 0.1 W; ComponentLink1Description: Link; ComponentLink1URL: https://www.digikey.com/en/products/detail/panasonic-electronic-components/ERJ-PB3B5102V/6212949
R2 R6 = 22K1 0603: 22K1 0.1W 1% 0603 (1608 Metric)  SMD; Case-EIA: 0603; Case-Metric: 1608; Value: 22100.00 Ohm; Tolerance: 1 %; Power: 0.1 W; Technology: SMT; ComponentLink1Description: Link; ComponentLink1URL: https://www.digikey.com/en/products/detail/yageo/RC0603FR-0722K1L/727058
R4 = 88K7 0603: 88K7 0.1W 1% 0603 (1608 Metric)  SMD; Value: 88700.00 Ohm; Case-Metric: 1608; Case-EIA: 0603; Tolerance: 1 %; Power: 0.1 W; Technology: SMT; ComponentLink1Description: Link; ComponentLink1URL: https://www.digikey.com/en/products/detail/yageo/RC0603FR-0788K7L/727415
R38 = 1M5 0603: CRCW06031M50FKEA-1M5 0603; Manufacturer: Vishay Dale; Part Number: CRCW06031M50FKEA; ComponentLink1Description: Link; ComponentLink1URL: https://www.digikey.com/en/products/detail/yageo/RC0603FR-071M5L/726865
R39 = 100K 0603: ERJ-3EKF1003V-100k 0603; Manufacturer: Panasonic; Part Number: ERJ-3EKF1003V; ComponentLink1Description: Link; ComponentLink1URL: https://www.digikey.com/en/products/detail/yageo/RC0603FR-07100KL/726889
R40 = 3R3 0603: ERJ-3RQF3R3V- 3R3 0603; Manufacturer: Panasonic; Part Number: ERJ-3RQF3R3V; ComponentLink1Description: Link; ComponentLink1URL: https://www.digikey.com/en/products/detail/yageo/RC0603FR-133R3L/14008285
R41 = 41K2 0603: ERA3AEB4122V-41k2 0603; Manufacturer: Panasonic; Part Number: ERA3AEB4122V; ComponentLink1Description: Link; ComponentLink1URL: https://www.digikey.com/en/products/detail/yageo/RC0603FR-1041K2L/14008303
R42 = 5K6 0603: Chip Resistor, 5.6 KOhm, +/- 1%, 0.1 W, -55 to 155 degC, 0603 (1608 Metric), RoHS, Tape and Reel; Elements: 1; Max Power Dissipation: 625 mW; hFE Min: 100; Case\Package: TO-236-3; Frequency: 300 MHz; Vce Max: 300 mV; Packaging: Tape and Reel; PackageReference: 0603; RoHSCompliant: true; ComponentLink1URL: http://www.panasonic.com/; ComponentLink2Description: Datasheet; REACH SVHC: No SVHC; PackageDescription: 2-Pin Surface Mount Device, Body 1.6 x 0.85 mm; Mount: Surface Mount; Height: 0.25 inch; Max Operating Temperature: 150 degC; Min Operating Temperature: -55 degC; ComponentLink1Description: Manufacturer URL; Width: 0.25 inch; Package Quantity: 3000; Length: 0.25 inch; DatasheetVersion: Apr-15; Pins: 3; ComponentLink2URL: http://industrial.panasonic.com/cdbs/www-data/pdf/RDA0000/AOA0000C86.pdf; Weight: 0.002116 oz; Radiation Hardening: No; ComponentLink3Description: Link; ComponentLink3URL: https://www.digikey.com/en/products/detail/yageo/RC0603FR-135K6L/14286727
U2 U4 = LMR23630-Q1: Manufacturer: Texas Instruments; Manufacturer Part Number: LMR23630AFQDDARQ1; Function: Step-Down; Output Configuration: Positive; Topology: Buck; Output Type: Adjustable; Number of Outputs: 1; Voltage - Input (Min): 4.5V; Voltage - Input (Max): 36V; Voltage - Output (Min/Fixed): 1V; Voltage - Output (Max): 28V; Current - Output: 3A; Frequency - Switching: 400kHz; Synchronous Rectifier: Yes; Supplier 1: Digi-Key; RoHS: RoHS Compliant; Category: Integrated Circuits (ICs); Stock 1: 1636; Pricing 1: 1=3.97, 10=3.564, 100=2.9204, 500=2.48604, 1000=2.09667 (USD); Packaging: Digi-Reel®; Part Status: Active; Operating Temperature: -40°C ~ 125°C (TJ); Mounting Type: Surface Mount; Package / Case: 8-SOIC (0.154", 3.90mm Width) Exposed Pad; Supplier Device Package: 8-SO PowerPad; ComponentLink1URL: http://www.ti.com/lit/ds/symlink/lmr23630-q1.pdf; ComponentLink1Description: http://www.ti.com/lit/ds/symlink/lmr23630-q1.pdf; Supplier Part Number 1: 296-45260-6-ND; ComponentLink2Description: Link; ComponentLink2URL: https://www.digikey.com/en/products/detail/texas-instruments/LMR23630AQDDARQ1/6590816
U9 = MP8756GD-P: No Description Available; Mfr_Name: Monolithic Power Systems; RefDes: RefDes; Type: Type

## Sheet Sht3-V12P0_reg.SchDoc
size C; SheetNumber: 3; SheetTotal: 4
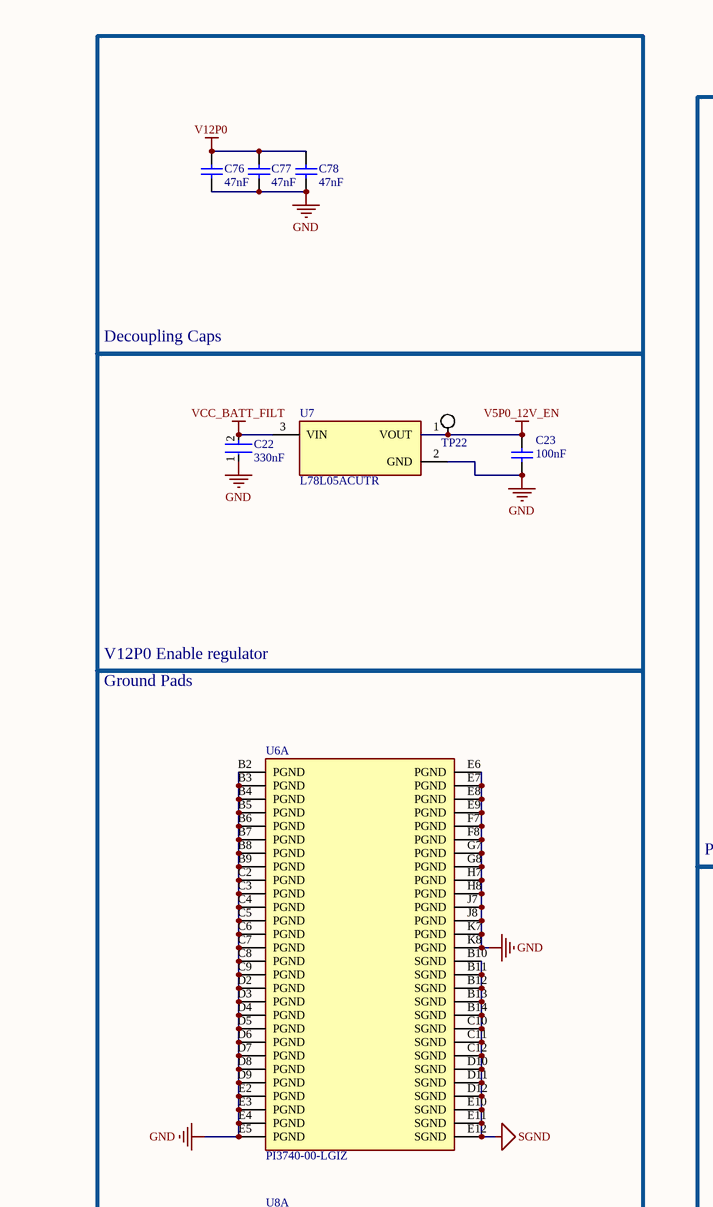
[diagram p4: Sht3-V12P0_reg.SchDoc, top left]
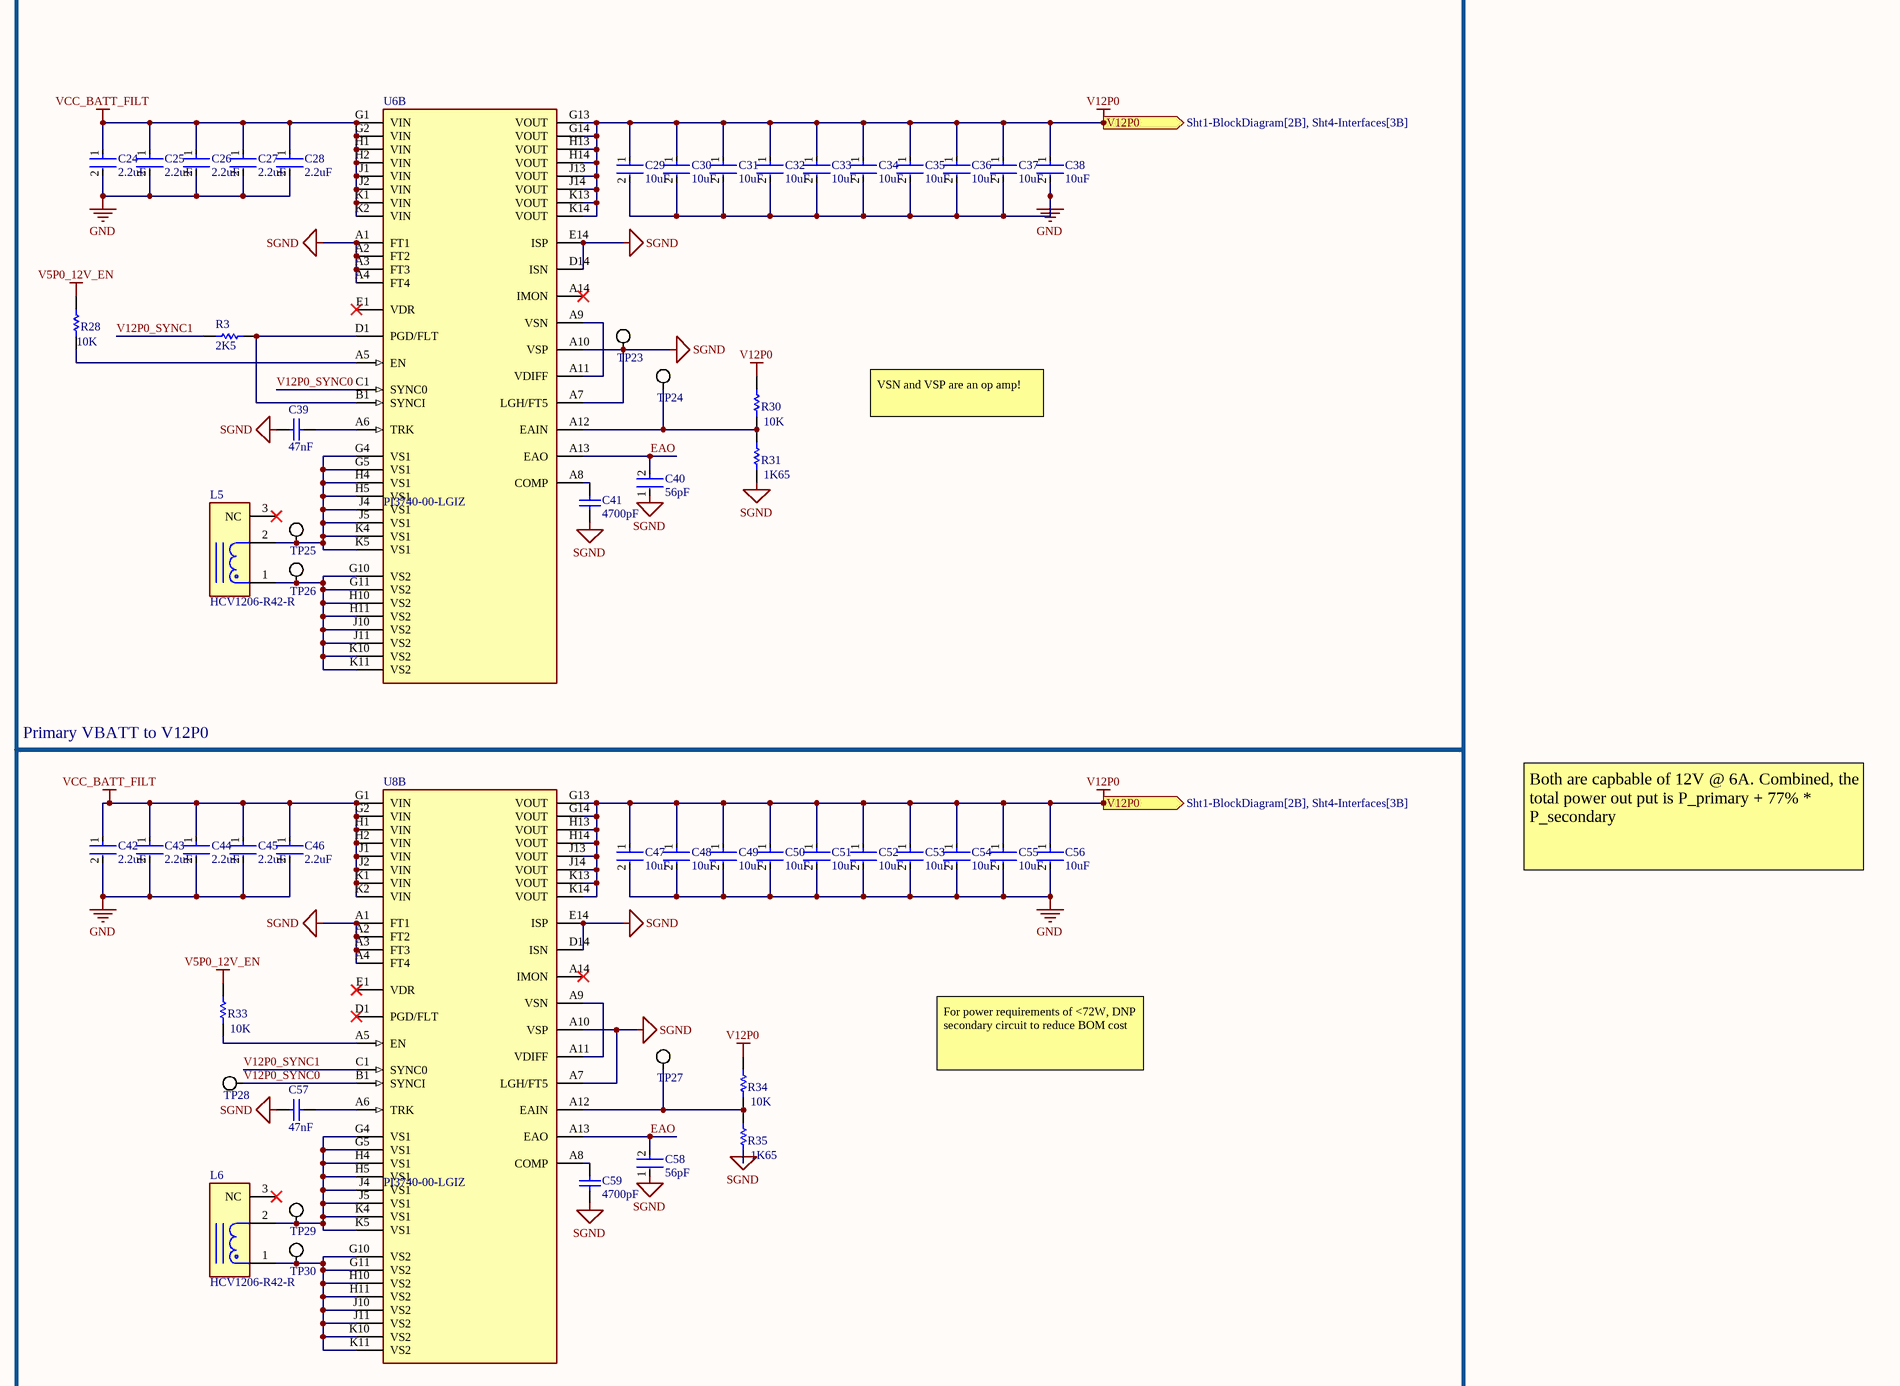
[diagram p5: Sht3-V12P0_reg.SchDoc, top right]
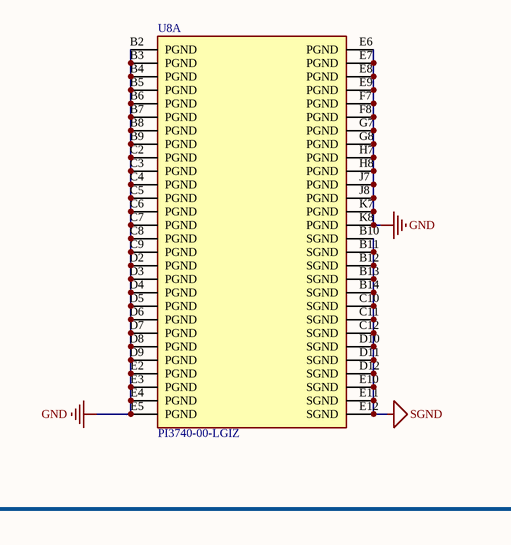
[diagram p6: Sht3-V12P0_reg.SchDoc, bottom left]
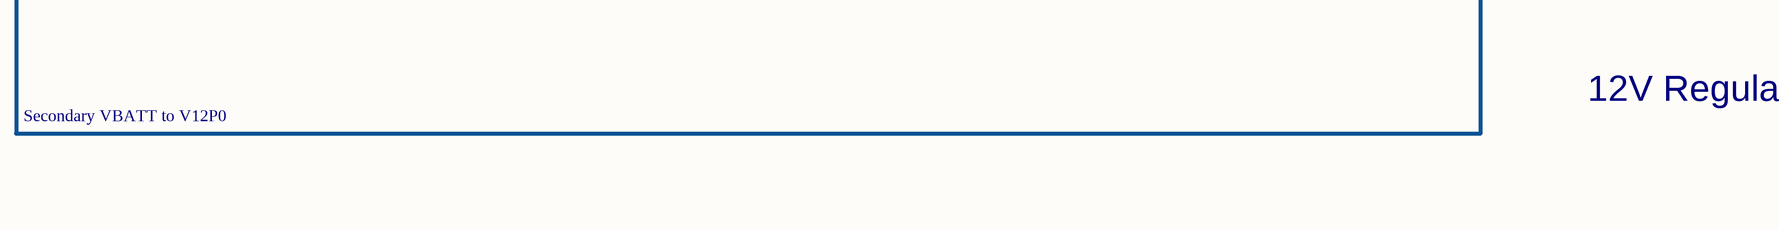
[diagram p7: Sht3-V12P0_reg.SchDoc, bottom right]

### Parts
C22  330nF  [FP-C1608-080-0_1-IPC_A]
C23  100nF  [CAPC0603(1608)100_L]
C24  2.2uF  [FP-1210-L_3_3_0_4-W_2_5_0-IPC_B]
C25  2.2uF  [FP-1210-L_3_3_0_4-W_2_5_0-IPC_B]
C26  2.2uF  [FP-1210-L_3_3_0_4-W_2_5_0-IPC_B]
C27  2.2uF  [FP-1210-L_3_3_0_4-W_2_5_0-IPC_B]
C28  2.2uF  [FP-1210-L_3_3_0_4-W_2_5_0-IPC_B]
C29  10uF  [FP-GRM32-MFG]
C30  10uF  [FP-GRM32-MFG]
C31  10uF  [FP-GRM32-MFG]
C32  10uF  [FP-GRM32-MFG]
C33  10uF  [FP-GRM32-MFG]
C34  10uF  [FP-GRM32-MFG]
C35  10uF  [FP-GRM32-MFG]
C36  10uF  [FP-GRM32-MFG]
C37  10uF  [FP-GRM32-MFG]
C38  10uF  [FP-GRM32-MFG]
C39  47nF  [CAPC1608X90X35LL10T15]
C40  56pF  [FP-C1608-080-0_1-IPC_C]
C41  4700pF  [CAPC1608X90X35ML10T15]
C42  2.2uF  [FP-1210-L_3_3_0_4-W_2_5_0-IPC_B]
C43  2.2uF  [FP-1210-L_3_3_0_4-W_2_5_0-IPC_B]
C44  2.2uF  [FP-1210-L_3_3_0_4-W_2_5_0-IPC_B]
C45  2.2uF  [FP-1210-L_3_3_0_4-W_2_5_0-IPC_B]
C46  2.2uF  [FP-1210-L_3_3_0_4-W_2_5_0-IPC_B]
C47  10uF  [FP-GRM32-MFG]
C48  10uF  [FP-GRM32-MFG]
C49  10uF  [FP-GRM32-MFG]
C50  10uF  [FP-GRM32-MFG]
C51  10uF  [FP-GRM32-MFG]
C52  10uF  [FP-GRM32-MFG]
C53  10uF  [FP-GRM32-MFG]
C54  10uF  [FP-GRM32-MFG]
C55  10uF  [FP-GRM32-MFG]
C56  10uF  [FP-GRM32-MFG]
C57  47nF  [CAPC1608X90X35LL10T15]
C58  56pF  [FP-C1608-080-0_1-IPC_C]
C59  4700pF  [CAPC1608X90X35ML10T15]
C76  47nF  [CAPC1608X90X35LL10T15]
C77  47nF  [CAPC1608X90X35LL10T15]
C78  47nF  [CAPC1608X90X35LL10T15]
L5  HCV1206-R42-R  [FP-HCV1206-R42-R-MFG]
L6  HCV1206-R42-R  [FP-HCV1206-R42-R-MFG]
R3  2K5  [RESC1608X55X25NL10T15]
R28  10K  [RESC1609X50X30NL8T20]
R30  10K  [RESC1609X50X30NL8T20]
R31  1K65  [RESC1608X55X25ML10T15]
R33  10K  [RESC1609X50X30NL8T20]
R34  10K  [RESC1609X50X30NL8T20]
R35  1K65  [RESC1608X55X25ML10T15]
TP22  Test Point Pad  [Test Point Pad]  (value not drawn)
TP23  Test Point Pad  [Test Point Pad]  (value not drawn)
TP24  Test Point Pad  [Test Point Pad]  (value not drawn)
TP25  Test Point Pad  [Test Point Pad]  (value not drawn)
TP26  Test Point Pad  [Test Point Pad]  (value not drawn)
TP27  Test Point Pad  [Test Point Pad]  (value not drawn)
TP28  Test Point Pad  [Test Point Pad]  (value not drawn)
TP29  Test Point Pad  [Test Point Pad]  (value not drawn)
TP30  Test Point Pad  [Test Point Pad]  (value not drawn)
U6  PI3740-00-LGIZ  [FP-PI3740-00-LGIZ-MFG]  (parts A,B of 2)
U7  L78L05ACUTR  [FP-SOT-89-7098166-MFG]
U8  PI3740-00-LGIZ  [FP-PI3740-00-LGIZ-MFG]  (parts A,B of 2)

### Blocks framed on the sheet
Decoupling Caps: C76-C78
Primary VBATT to V12P0: C24-C41 L5 R3 R28 R30 R31 TP23-TP26 U6
Secondary VBATT to V12P0: C42-C59 L6 R33-R35 TP27-TP30 U8

### Ports
V12P0 (out, see Sht1-BlockDiagram[2B], Sht4-Interfaces[3B])

### Nets
GND: C22.1 C23.1 C24.2 C25.2 C26.2 C27.2 C28.2 C29.2 C30.2 C31.2 C32.2 C33.2 C34.2 C35.2 C36.2 C37.2 C38.2 C42.2 C43.2 C44.2 C45.2 C46.2 C47.2 C48.2 C49.2 C50.2 C51.2 C52.2 C53.2 C54.2 C55.2 C56.2 C76.1 C77.1 C78.1 U6.B2(PGND) U6.B3(PGND) U6.B4(PGND) U6.B5(PGND) U6.B6(PGND) U6.B7(PGND) U6.B8(PGND) U6.B9(PGND) U6.C2(PGND) U6.C3(PGND) U6.C4(PGND) U6.C5(PGND) U6.C6(PGND) U6.C7(PGND) U6.C8(PGND) U6.C9(PGND) U6.D2(PGND) U6.D3(PGND) U6.D4(PGND) U6.D5(PGND) U6.D6(PGND) U6.D7(PGND) U6.D8(PGND) U6.D9(PGND) U6.E2(PGND) U6.E3(PGND) U6.E4(PGND) U6.E5(PGND) U6.E6(PGND) U6.E7(PGND) U6.E8(PGND) U6.E9(PGND) U6.F7(PGND) U6.F8(PGND) U6.G7(PGND) U6.G8(PGND) U6.H7(PGND) U6.H8(PGND) U6.J7(PGND) U6.J8(PGND) U6.K7(PGND) U6.K8(PGND) U7.2(GND) U8.B2(PGND) U8.B3(PGND) U8.B4(PGND) U8.B5(PGND) U8.B6(PGND) U8.B7(PGND) U8.B8(PGND) U8.B9(PGND) U8.C2(PGND) U8.C3(PGND) U8.C4(PGND) U8.C5(PGND) U8.C6(PGND) U8.C7(PGND) U8.C8(PGND) U8.C9(PGND) U8.D2(PGND) U8.D3(PGND) U8.D4(PGND) U8.D5(PGND) U8.D6(PGND) U8.D7(PGND) U8.D8(PGND) U8.D9(PGND) U8.E2(PGND) U8.E3(PGND) U8.E4(PGND) U8.E5(PGND) U8.E6(PGND) U8.E7(PGND) U8.E8(PGND) U8.E9(PGND) U8.F7(PGND) U8.F8(PGND) U8.G7(PGND) U8.G8(PGND) U8.H7(PGND) U8.H8(PGND) U8.J7(PGND) U8.J8(PGND) U8.K7(PGND) U8.K8(PGND)
SGND: C39.1 C40.1 C41.1 C57.1 C58.1 C59.1 R31.2 R35.2 TP23.1 U6.A1(FT1) U6.A2(FT2) U6.A3(FT3) U6.A4(FT4) U6.A7(LGH/FT5) U6.A10(VSP) U6.B10(SGND) U6.B11(SGND) U6.B12(SGND) U6.B13(SGND) U6.B14(SGND) U6.C10(SGND) U6.C11(SGND) U6.C12(SGND) U6.D10(SGND) U6.D11(SGND) U6.D12(SGND) U6.D14(ISN) U6.E10(SGND) U6.E11(SGND) U6.E12(SGND) U6.E14(ISP) U8.A1(FT1) U8.A2(FT2) U8.A3(FT3) U8.A4(FT4) U8.A7(LGH/FT5) U8.A10(VSP) U8.B10(SGND) U8.B11(SGND) U8.B12(SGND) U8.B13(SGND) U8.B14(SGND) U8.C10(SGND) U8.C11(SGND) U8.C12(SGND) U8.D10(SGND) U8.D11(SGND) U8.D12(SGND) U8.D14(ISN) U8.E10(SGND) U8.E11(SGND) U8.E12(SGND) U8.E14(ISP)
V5P0_12V_EN: C23.2 R28.1 R33.1 TP22.1 U7.1(VOUT)
V12P0: C29.1 C30.1 C31.1 C32.1 C33.1 C34.1 C35.1 C36.1 C37.1 C38.1 C47.1 C48.1 C49.1 C50.1 C51.1 C52.1 C53.1 C54.1 C55.1 C56.1 C76.2 C77.2 C78.2 R30.1 R34.1 U6.G13(VOUT) U6.G14(VOUT) U6.H13(VOUT) U6.H14(VOUT) U6.J13(VOUT) U6.J14(VOUT) U6.K13(VOUT) U6.K14(VOUT) U8.G13(VOUT) U8.G14(VOUT) U8.H13(VOUT) U8.H14(VOUT) U8.J13(VOUT) U8.J14(VOUT) U8.K13(VOUT) U8.K14(VOUT) ; port V12P0
VCC_BATT_FILT: C22.2 C24.1 C25.1 C26.1 C27.1 C28.1 C42.1 C43.1 C44.1 C45.1 C46.1 U6.G1(VIN) U6.G2(VIN) U6.H1(VIN) U6.H2(VIN) U6.J1(VIN) U6.J2(VIN) U6.K1(VIN) U6.K2(VIN) U7.3(VIN) U8.G1(VIN) U8.G2(VIN) U8.H1(VIN) U8.H2(VIN) U8.J1(VIN) U8.J2(VIN) U8.K1(VIN) U8.K2(VIN)
EAO: C40.2 C58.2 U6.A13(EAO) U8.A13(EAO)
V12P0_SYNC0: TP28.1 U6.C1(SYNC0) U8.B1(SYNCI)
V12P0_SYNC1: R3.1 U8.C1(SYNC0)
NetC39_2: C39.2 U6.A6(TRK)
NetC41_2: C41.2 U6.A8(COMP)
NetC57_2: C57.2 U8.A6(TRK)
NetC59_2: C59.2 U8.A8(COMP)
NetL5_1: L5.1 TP26.1 U6.G10(VS2) U6.G11(VS2) U6.H10(VS2) U6.H11(VS2) U6.J10(VS2) U6.J11(VS2) U6.K10(VS2) U6.K11(VS2)
NetL5_2: L5.2 TP25.1 U6.G4(VS1) U6.G5(VS1) U6.H4(VS1) U6.H5(VS1) U6.J4(VS1) U6.J5(VS1) U6.K4(VS1) U6.K5(VS1)
NetL6_1: L6.1 TP30.1 U8.G10(VS2) U8.G11(VS2) U8.H10(VS2) U8.H11(VS2) U8.J10(VS2) U8.J11(VS2) U8.K10(VS2) U8.K11(VS2)
NetL6_2: L6.2 TP29.1 U8.G4(VS1) U8.G5(VS1) U8.H4(VS1) U8.H5(VS1) U8.J4(VS1) U8.J5(VS1) U8.K4(VS1) U8.K5(VS1)
NetR3_2: R3.2 U6.B1(SYNCI) U6.D1(PGD/FLT)
NetR28_2: R28.2 U6.A5(EN)
NetR30_2: R30.2 R31.1 TP24.1 U6.A12(EAIN)
NetR33_2: R33.2 U8.A5(EN)
NetR34_2: R34.2 R35.1 TP27.1 U8.A12(EAIN)
NetU6_A9: U6.A9(VSN) U6.A11(VDIFF)
NetU8_A9: U8.A9(VSN) U8.A11(VDIFF)

Not connected (* = marked no-connect by the designer): L5 3(NC)*; L6 3(NC)*; U6 A14(IMON)* E1(VDR)*; U8 A14(IMON)* D1(PGD/FLT)* E1(VDR)*

### Notes on the sheet
- VSN and VSP are an op amp!
- V12P0 Enable regulator
- Ground Pads
- Both are capbable of 12V @ 6A. Combined, the total power out put is P_primary + 77% * P_secondary
- For power requirements of <72W, DNP secondary circuit to reduce BOM cost
- 12V Regulators

### Library data of the parts
C22 = CMP-2000-07551-2: Multilayer Ceramic Capacitors 330nF ±10% 50V X7R SMD 0603; Capacitance: 330nF; Case Code (Imperial): 0603; Case Code (Metric): 1608; Dielectric: X7R; Length: 1.6mm; Construction: Flat; Resistor Type: Ceramic; Mount: Surface Mount; Voltage Rating: 50V; Packaging: Tape and Reel; Series: C; Case/Package: 0603; Lead Free: Lead Free; Tolerance: 10%; Voltage: 50V; REACH SVHC: No SVHC; Height: 0.8mm; Weight: 7.1E-05oz; Termination: SMD/SMT; Max Operating Temperature: 125°C; RoHS Compliant: Yes; Min Operating Temperature: -55°C; Depth: 0.8mm; Package Quantity: 1; Thickness: 0.037inch; Voltage Rating (DC): 50V; Dielectric Material: Ceramic; Width: 0.031inch
C23 = CMP-1035-02595-1: CAP 100nF 100V ±10% 0603 (1608 Metric) Thickness 1mm SMD; Tolerance: Â±10%; Case-EIA: 0603; Case-Metric: 1608; Rated Voltage: 100 V; Value: 100nF; Technology: SMT; Max Thickness: 1 mm
C24-C28 C42-C46 = CMP-1038-02104-3: General Purpose Ceramic Capacitor, 1210, 2.2uF, 10%, X7R, 15%, 100V; Dissipation Factor: 2.5%; Number of Pins: 2; Lead Free: Lead Free; Voltage Rating: 100V; Min Operating Temperature: -55°C; Height: 2.79mm; Length: 3.2mm; Capacitance: 2.2uF; RoHS Compliant: Yes; Case/Package: 1210; Max Operating Temperature: 125°C; Radiation Hardening: No; Series: -; Case Code (Metric): 3225; Dielectric: X7R; Voltage Rating (DC): 100V; Packaging: Tape and Reel; Width: 2.5mm; Thickness: 0.11inch; Depth: 2.5mm; Contact Plating: Tin; REACH SVHC: No SVHC; Tolerance: 10%; Construction: Flat; Case Code (Imperial): 1210; Mount: Surface Mount; Package Quantity: 1; Termination: SMD/SMT; Voltage: 100V
C29-C38 C47-C56 = CMP-2000-05261-2: CAP CER 10UF 50V X7R 1210; Manufacturer Part Number: GRM32ER71H106KA12L; Manufacturer: Murata; Tolerance: 10%; Material: Ceramic; Temperature Coefficient: 15%; Voltage Rating: 50V; Temperature Characteristic: X7R; Value: 10uF; ComponentLink2Description: Datasheet; Device Class L1: Passive Components; Lead Free: Yes; Temperature Range High: +125°C; Category: Cap; ComponentLink2URL: https://search.murata.co.jp/Ceramy/image/img/A01X/G101/ENG/GRM32ER71H106KA12-01.pdf; Device Class L2: Capacitors; Package: GRM32; Mouser Description: 1210 10 uF 50 V ±10% Tolerance X7R SMT Multilayer Ceramic Capacitor; Capacitance: 10uF; Octopart: https://octopart.com/grm32er71h106ka12l-murata-10470987; Digikey Description: CAP CER 10UF 50V X7R 1210; Height: 2.7mm; Temperature: -55°C to +125°C; Temperature Range Low: -55°C; RoHS: TRUE; Device Class L3: Ceramic Capacitors; Automotive: No
C39 C57 C76-C78 = CMP-2006-02884-1: 47nF 0603; Manufacturer: Murata; Part Number: GRM188R71E473KA01D
C40 C58 = CMP-08246-005165-1: Multilayer Ceramic Capacitors 56pF ±5% 50V C0G SMD 0603; Voltage Rating (DC): 50V; Lead Free: Lead Free; Termination: SMD/SMT; Min Operating Temperature: -55°C; Dielectric: C0G; Dielectric Material: Ceramic; Packaging: Tape and Reel; REACH SVHC: No SVHC; Case Code (Imperial): 0603; Package Quantity: 1; Case/Package: 0603; Tolerance: 5%; Mount: Surface Mount; Depth: 0.8mm; Series: C; Construction: Flat; Max Operating Temperature: 125°C; RoHS Compliant: Yes; Thickness: 0.037inch; Radiation Hardening: No; Width: 0.031inch; Height: 0.8mm; Capacitance: 56pF; Voltage Rating: 50V; Weight: 7.1E-05oz; Case Code (Metric): 1608; Length: 1.6mm
C41 C59 = CMP-2006-02483-1: 4700pF 0603; Part Number: GRM188R72A472KA01D; Manufacturer: Murata
L5 = CMP-16092-000011-1: HCV1206-R42-R -FIXED IND 420NH 16A 3.15 MOHM; Shielding: Unshielded; Tolerance: 10%; DC Resistance (DCR): 3.15mR; Core Material: Ferrite; Saturation Current: 42A; Test Frequency: 100kHz; Mount: Surface Mount; Length: 0.48inch; Width: 0.386inch; Resistor Type: Wirewound; RoHS Compliant: Yes; Packaging: Tape and Reel; Min Operating Temperature: -55°C; Case/Package: Nonstandard; Height - Seated (Max): 0.201inch; Max Operating Temperature: 125°C; Current Rating: 16A; Lead Free: Lead Free; Inductance: 420nH
L6 = CMP-16092-000011-1: FIXED IND 420NH 16A 3.15 MOHM; Shielding: Unshielded; Tolerance: 10%; DC Resistance (DCR): 3.15mR; Core Material: Ferrite; Saturation Current: 42A; Test Frequency: 100kHz; Mount: Surface Mount; Length: 0.48inch; Width: 0.386inch; Resistor Type: Wirewound; RoHS Compliant: Yes; Packaging: Tape and Reel; Min Operating Temperature: -55°C; Case/Package: Nonstandard; Height - Seated (Max): 0.201inch; Max Operating Temperature: 125°C; Current Rating: 16A; Lead Free: Lead Free; Inductance: 420nH
R3 = CMP-2000-03984-1: 2.5K 0603; Manufacturer: Yageo; Part Number: RC0603FR-072K55L
R28 R30 R33 R34 = CMP-1666-00005-4: Chip Resistor, 10 KOhm, +/- 1%, 100 mW, -55 to 155 degC, 0603 (1608 Metric), RoHS, Tape and Reel; Manufacturer: Vishay Semiconductor; Voltage Rating: 75 V; Max Operating Temperature: 155 degC; PackageDescription: 2-Pin Surface Mount Device, Body 1.575 x 0.85 mm; ComponentLink1Description: Manufacturer URL; RoHSCompliant: true; PackageReference: 0603; REACH SVHC: Unknown; Length: 1.55 mm; DatasheetVersion: 06/2012; Packaging: Tape and Reel; Min Operating Temperature: -55 degC; Mounting Technology: Surface Mount; ComponentLink2URL: https://datasheet.ciiva.com/11809/0900766b80d98afc-11809037.pdf; Height: 0.45 mm; ComponentLink2Description: Datasheet; Package Quantity: 5000; ComponentLink1URL: http://www.vishay.com/
R31 R35 = CMP-2000-03935-1: 1.65k 0603; Part Number: RC0603FR-071K65L; Manufacturer: Yageo
TP22-TP30 = Test Point Pad: Test point, Pad, 28 mil
U6 U8 = CMP-25822-000003-1: DC DC CONVERTER 10-50V; Max Output Current: 6.5A; Max Input Voltage: 60V; Voltage - Output 1: 50V; Min Input Voltage: 8V; Efficiency: 96%; Number of Outputs: 1; Max Operating Temperature: 115°C; Features: UVLO; Series: Cool-Power® (140W); RoHS Compliant: Yes; Min Operating Temperature: -40°C; Mount: Surface Mount; Case/Package: LGA; Packaging: Tray
U7 = CMP-0244-00407-2: IC REG LINEAR 5V 100MA SOT89-3; Output Voltage Accuracy: 4%; Number of Regulators: 1; Polarity: Positive; Quiescent Current: 6mA; Min Input Voltage: 7V; Power Supply Rejection Ratio (PSRR): 49dB; Output Type: Fixed; Max Input Voltage: 30V; Dropout Voltage: 1.7V; Nominal Output Voltage: 5V; Radiation Hardening: No; Number of Pins: 3; Weight: 0.004603oz; Output Current: 100mA; Width: 2.6mm; Packaging: Tape and Reel; Output Voltage: 5V; Length: 4.6mm; Max Output Current: 100mA; Min Operating Temperature: 0°C; Package Quantity: 1; Accuracy: 4%; Case/Package: SOT-89; Lead Free: Lead Free; Height: 1.6mm; Min Output Voltage: 5V; Contact Plating: Tin; Number of Outputs: 1; REACH SVHC: No SVHC; Mount: Surface Mount; Max Operating Temperature: 125°C